# EAGLE design Controller (EAGLE 6.3)
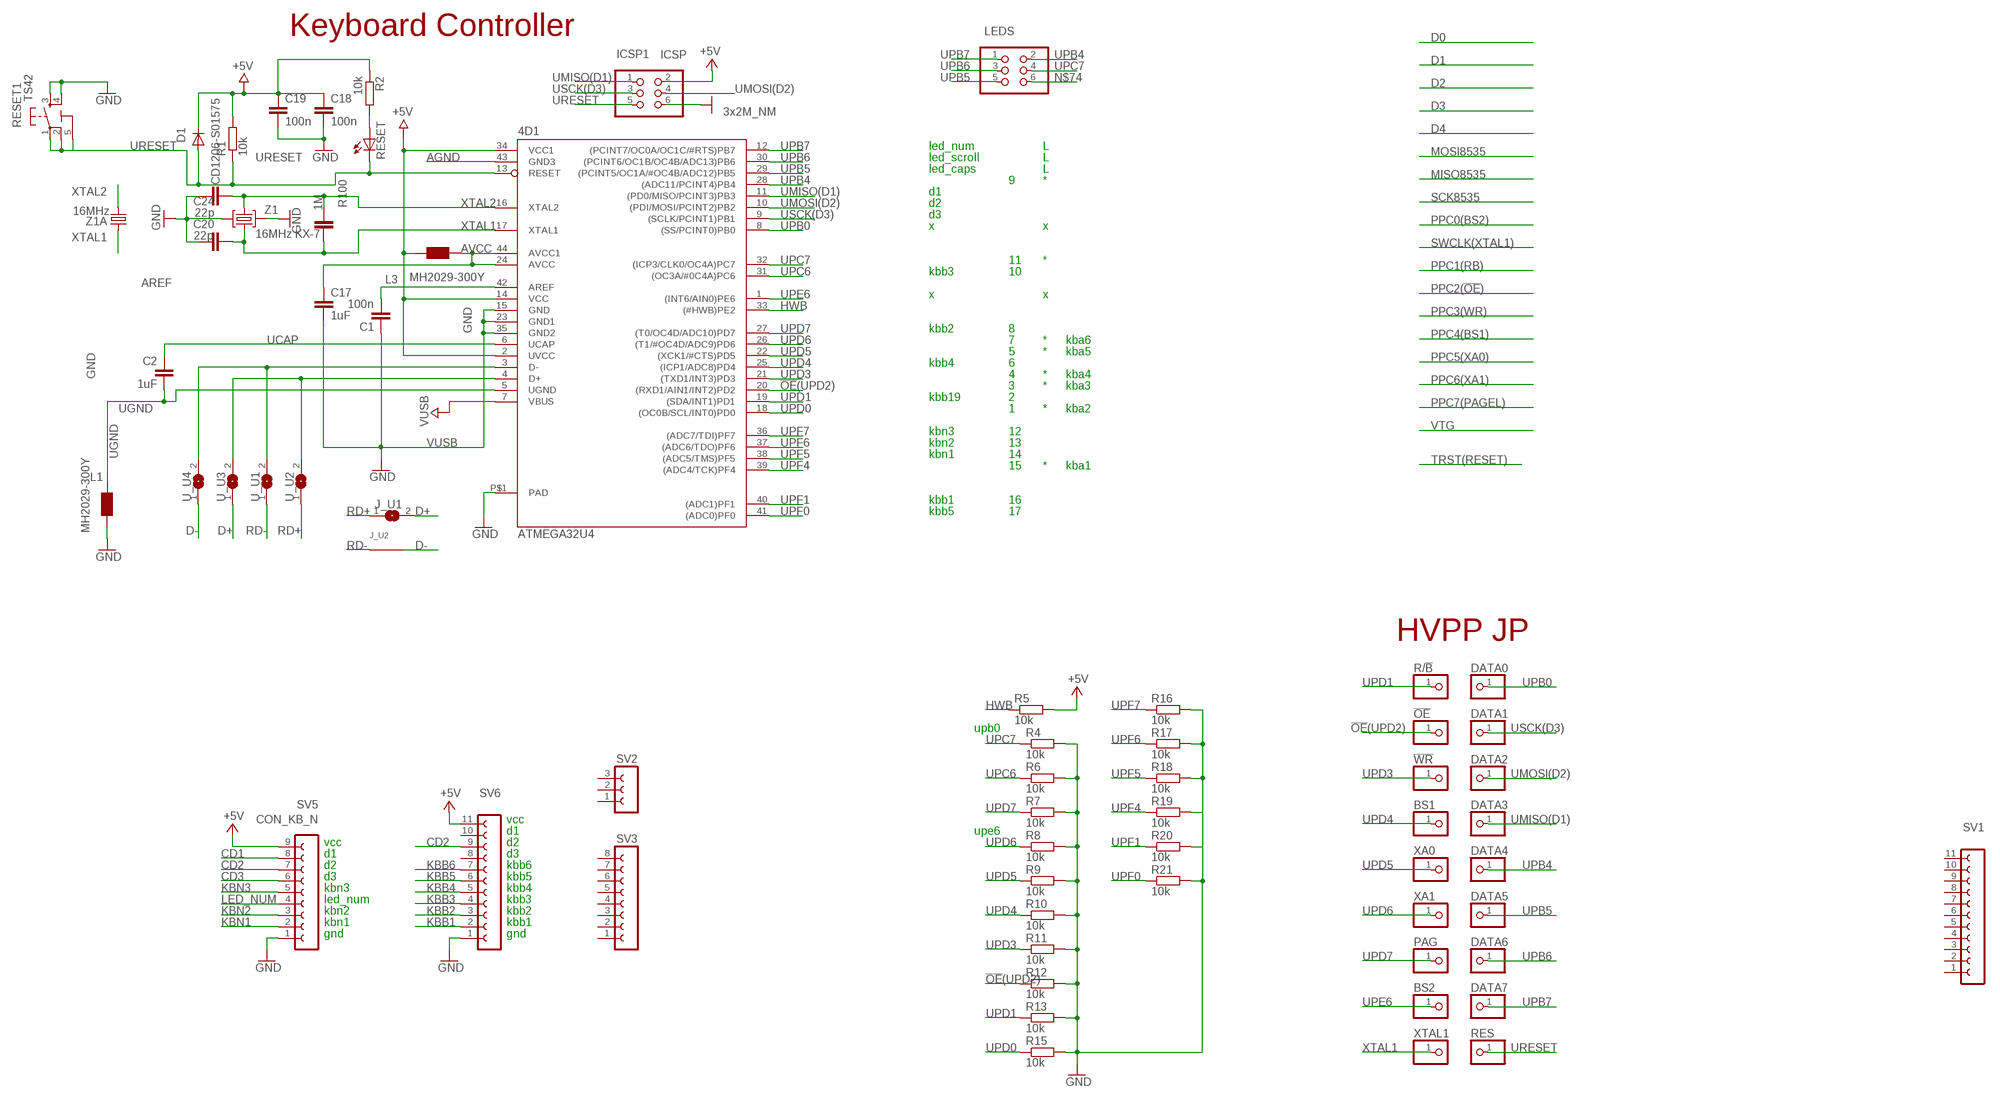
[diagram p0: schematic, sheet 1, part 1 of 2]
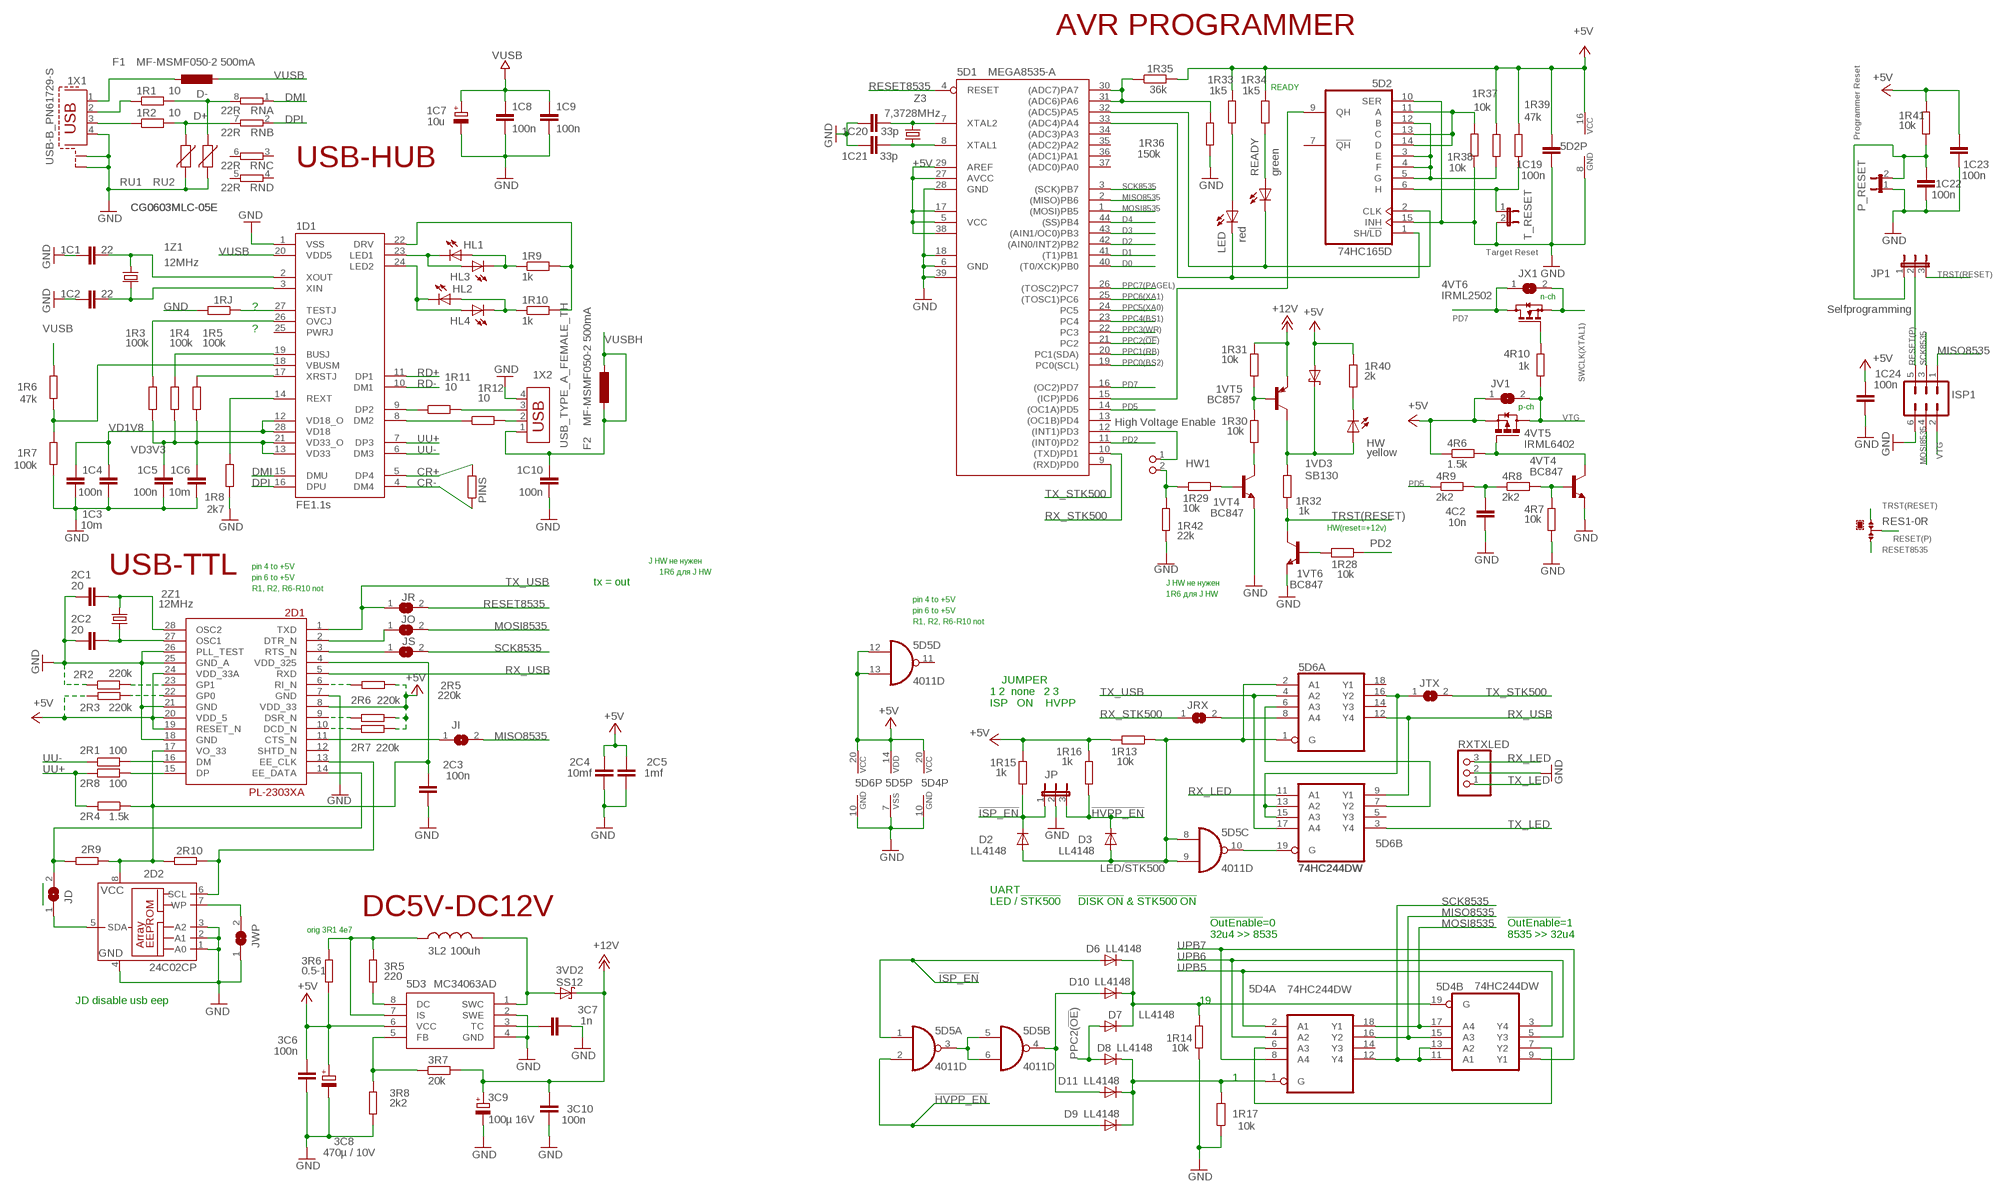
[diagram p1: schematic, sheet 1, part 2 of 2]

## Parts
1C1  22  C-EUC0603  [C0603]
1C2  22  C-EUC0603  [C0603]
1C3  10m  C-EUC1206  [C1206]
1C4  100n  C-EUC0805  [C0805]
1C5  100n  C-EUC0805  [C0805]
1C6  10m  C-EUC1206  [C1206]
1C7  10u  CPOL-EUSMCB  [SMC_B]
1C8  100n  C-EUC0805  [C0805]
1C9  100n  C-EUC0805  [C0805]
1C10  100n  C-EUC0805  [C0805]
1C19  100n  C-EUC0805  [C0805]
1C20  33p  C-EUC0805  [C0805]
1C21  33p  C-EUC0805  [C0805]
1C22  100n  C-EUC0805  [C0805]
1C23  100n  C-EUC0805  [C0805]
1C24  100n  C-EUC0805  [C0805]
1D1  FE1.1S  [FE1.1S_SSOP-28]
1R1  10  R-EU_R0603  [R0603]
1R2  10  R-EU_R0603  [R0603]
1R3  100k  R-EU_R0805  [R0805]
1R4  100k  R-EU_R0805  [R0805]
1R5  100k  R-EU_R1206W  [R1206W]
1R6  47k  R-EU_R1206W  [R1206W]
1R7  100k  R-EU_R0805  [R0805]
1R8  2k7  R-EU_R0805  [R0805]
1R9  1k  R-EU_R0805  [R0805]
1R10  1k  R-EU_R0805  [R0805]
1R11  10  R-EU_R0603  [R0603]
1R12  10  R-EU_R0603  [R0603]
1R13  10k  R-EU_M0805  [M0805]
1R14  10k  R-EU_M0805  [M0805]
1R15  1k  R-EU_M0805  [M0805]
1R16  1k  R-EU_M0805  [M0805]
1R17  10k  R-EU_M0805  [M0805]
1R28  10k  R-EU_R0805  [R0805]
1R29  10k  R-EU_M0805  [M0805]
1R30  10k  R-EU_M0805  [M0805]
1R31  10k  R-EU_M0805  [M0805]
1R32  1k  R-EU_M0805  [M0805]
1R33  1k5  R-EU_M0805  [M0805]
1R34  1k5  R-EU_M0805  [M0805]
1R35  36k  R-EU_M0805  [M0805]
1R36  150k  R-EU_R1206  [R1206]
1R37  10k  R-EU_M0805  [M0805]
1R38  10k  R-EU_M0805  [M0805]
1R39  47k  R-EU_M0805  [M0805]
1R40  2k  R-EU_R1206W  [R1206W]
1R41  10k  R-EU_M0805  [M0805]
1R42  22k  R-EU_M1206  [M1206]
1RJ  R-EU_R0805  [R0805]
1VD3  SB130  SCHOTTKY-DIODESMD  [SMB]
1VT4  BC847  [SOT23]
1VT5  BC857  BC857A-PNP-SOT23-BEC  [SOT23-BEC]
1VT6  BC847  [SOT23]
1X1  USB-B_PN61729-S  [USB-B_PN61729-S]
1X2  USB_TYPE_A_FEMALE_TH  [USB_TYPE_A_FEMALE_TH]
1Z1  12MHz  CRYSTALHC49S  [HC49/S]
2C1  20  C-EUC0805  [C0805]
2C2  20  C-EUC0805  [C0805]
2C3  100n  C-EUC0805  [C0805]
2C4  10mf  C-EUC1210  [C1210]
2C5  1mf  C-EUC0805  [C0805]
2D1  PL-2303XA  [SSOP28DB]
2D2  24C02CP  [DIL8]
2R1  100  R-EU_R0603  [R0603]
2R2  220k  R-EU_R0603  [R0603]
2R3  220k  R-EU_R1206W  [R1206W]
2R4  1.5k  R-EU_R0603  [R0603]
2R5  220k  R-EU_R1206W  [R1206W]
2R6  220k  R-EU_R0603  [R0603]
2R7  220k  R-EU_R0603  [R0603]
2R8  100  R-EU_R0603  [R0603]
2R9  R-EU_R0805  [R0805]
2R10  R-EU_R0805  [R0805]
2Z1  12MHz  CRYSTALHC49S  [HC49/S]
3C6  100n  C-EU025-024X044  [C025-024X044]
3C7  1n  C-EU025-025X050  [C025-025X050]
3C8  470µ / 10V  RCL_CPOL-EUE3.5-8  [RCL_E3,5-8]
3C9  100µ 16V  RCL_CPOL-EUE3.5-8  [RCL_E3,5-8]
3C10  100n  C-EU025-025X050  [C025-025X050]
3L2  100uh  L-US0207/10  [0207/10]
3R5  220  R-EU_R1206  [R1206]
3R6  0.5-1  R-EU_M1206  [M1206]
3R7  20k  R-EU_M0805  [M0805]
3R8  2k2  R-EU_M0805  [M0805]
3VD2  SS12  SCHOTTKY-DIODESMD  [SMB]
4C2  10n  C-EUC1206  [C1206]
4D1  ATMEGA32U4  SMARTPRJ_ATMEGA32U4-XUAU  [SMARTPRJ_TQFP44-PAD]
4R6  1.5k  R-EU_M0805  [M0805]
4R7  10k  R-EU_M0805  [M0805]
4R8  2k2  R-EU_M1206  [M1206]
4R9  2k2  R-EU_M0805  [M0805]
4R10  1k  R-EU_M0805  [M0805]
4VT4  BC847  [SOT23]
4VT5  IRML6402  FDN360P  [SUPER-SOT3]
4VT6  IRML2502  BSS123  [SOT23]
5D1  MEGA8535-A  [TQFP44]
5D2  74HC165D  [SO16]
5D3  MC34063AD  [SOIC8]
5D4  74HC244DW  [SO20W]
5D5  4011D  [SO14]
5D6  74HC244DW  [SO20W]
!OE  PINHD-1X1  [1X01]
!WR  PINHD-1X1  [1X01]
BS1  PINHD-1X1  [1X01]
BS2  PINHD-1X1  [1X01]
C1  100n  C-EUC0603  [C0603-ROUND]
C2  1uF  C-EUC0603  [C0603]
C17  1uF  C-EUC0603  [C0603-ROUND]
C18  100n  C-EUC0603  [C0603]
C19  100n  C-EUC0603  [C0603-ROUND]
C20  22p  C-EUC0603  [C0603]
C24  22p  C-EUC0603  [C0603]
D1  CD1206-S01575  DIODE-MINIMELF  [MINIMELF]
D2  LL4148  [SOD80C]
D3  LL4148  [SOD80C]
D6  LL4148  [SOD80C]
D7  LL4148  [SOD80C]
D8  LL4148  [SOD80C]
D9  LL4148  [SOD80C]
D10  LL4148  [SOD80C]
D11  LL4148  [SOD80C]
DATA0  PINHD-1X1  [1X01]
DATA1  PINHD-1X1  [1X01]
DATA2  PINHD-1X1  [1X01]
DATA3  PINHD-1X1  [1X01]
DATA4  PINHD-1X1  [1X01]
DATA5  PINHD-1X1  [1X01]
DATA6  PINHD-1X1  [1X01]
DATA7  PINHD-1X1  [1X01]
F1  MF-MSMF050-2 500mA  L-EUL1812  [L1812]
F2  MF-MSMF050-2 500mA  L-EUL1812  [L1812]
HL1  LEDSML0603  [SML0603]
HL2  LEDSML0603  [SML0603]
HL3  LEDSML0603  [SML0603]
HL4  LEDSML0603  [SML0603]
HW  yellow  LEDSML0603  [SML0603]
HW1  High Voltage Enable  PINHEAD_PINHD-1X2  [PINHEAD_1X02]
ICSP1  ICSP  PINHD-2X3  [2X03]
ISP1  MA03-2  [MA03-2]
J_U1  SJ  [SJ]
J_U2  J  [R1206W]
JD  SJ  [SJ]
JI  SJ  [SJ]
JO  SJ  [SJ]
JP  JP2E  [JP2]
JP1  Selfprogramming  JUMPER_JP2E  [JUMPER_JP2]
JR  SJ  [SJ]
JRX  SJ  [SJ]
JS  SJ  [SJ]
JTX  SJ  [SJ]
JV1  SJ  [SJ]
JWP  SJ  [SJ]
JX1  SJ  [SJ]
L1  MH2029-300Y  WE-CBF_0805  [0805]
L3  MH2029-300Y  WE-CBF_0805  [0805]
LED  red  LEDSML0603  [SML0603]
LEDS  PINHD-2X3  [2X03]
P_RESET  JP1E  [JP1]
PAG  PINHD-1X1  [1X01]
PINS  R-EU_R0805  [R0805]
R1  10k  R-EU_M0805  [M0805]
R2  10k  R-EU_M0805  [M0805]
R4  10k  R-EU_M0805  [M0805]
R5  10k  R-EU_M1206  [M1206]
R6  10k  R-EU_M0805  [M0805]
R7  10k  R-EU_M0805  [M0805]
R8  10k  R-EU_M0805  [M0805]
R9  10k  R-EU_M0805  [M0805]
R10  10k  R-EU_M0805  [M0805]
R11  10k  R-EU_M0805  [M0805]
R12  10k  R-EU_M0805  [M0805]
R13  10k  R-EU_M0805  [M0805]
R15  10k  R-EU_M0805  [M0805]
R16  10k  R-EU_M0805  [M0805]
R17  10k  R-EU_M0805  [M0805]
R18  10k  R-EU_M0805  [M0805]
R19  10k  R-EU_M0805  [M0805]
R20  10k  R-EU_M0805  [M0805]
R21  10k  R-EU_M0805  [M0805]
R100  1M  C-EUC0805  [C0805]
R/!B  PINHD-1X1  [1X01]
READY  green  LEDSML0603  [SML0603]
RES  PINHD-1X1  [1X01]
RES1  0R-JUMPA  [A0R-JMP]
RESET  LEDSML0805  [SML0805]
RESET1  TS42  [TS42]
RN  22R  4R-NCAY16  [CAY16]
RU1  CG0603MLC-05E  VARISTORCN0603  [CT/CN0603]
RU2  CG0603MLC-05E  VARISTORCN0603  [CT/CN0603]
RXTXLED  PINHD-1X3  [1X03]
SV1  FE12-1  [FE12]
SV2  FE03-1  [FE03-1]
SV3  FE08-1  [FE08]
SV5  CON_KB_N  FE09-1  [FE09]
SV6  FE12-1  [FE12]
T_RESET  JP1E  [JP1]
U_U1  SJ  [SJ]
U_U2  SJ  [SJ]
U_U3  SJ  [SJ]
U_U4  SJ  [SJ]
XA0  PINHD-1X1  [1X01]
XA1  PINHD-1X1  [1X01]
XTAL1  PINHD-1X1  [1X01]
Z1  16MHz KX-7  CRYSTAL-3.2-2.5  [CRYSTAL-3.2-2.5]
Z1A  16MHz  CRYSTALHC49S  [HC49/S]
Z3  7,3728MHz  CRYTALHC49U-V  [HC49U-V]

## Nets
3VUSB2: 2C3.1 2D1.4(VDD_325) 2D1.17(VO_33) 2D2.8(VCC) 2R4.1 2R9.2 2R10.2
!HVPP_EN: 1R16.1 5D5.2(A:I1) D3.C D9.A JP.3
!ISP_EN: 1R15.1 5D5.1(A:I0) D2.C D6.A JP.1
!OE741: 1R17.2 5D4.1(A:G) D8.C D9.C D11.C
!OE!(UPD2): 4D1.20((RXD1/AIN1/INT2)PD2) !OE.1 R12.1
+5V: 1C19.1 1C23.2 1C24.2 1R13.2 1R15.2 1R16.2 1R33.2 1R34.2 1R35.2 1R37.1 1R39.1 1R40.2 1R41.2 1VD3.A 2C4.2 2C5.2 2D1.8(VDD_33) 2D1.19(RESET_N) 2D1.20(VDD_5) 2D1.24(VDD_33A) 2R3.1 2R5.2 2R6.1 2R7.1 3C6.1 3C8.+ 3R6.1 4D1.2(UVCC) 4D1.14(VCC) 4D1.34(VCC1) 4R6.1 4VT5.2(S) 5D1.5(VCC) 5D1.17(VCC1) 5D1.27(AVCC) 5D1.29(AREF) 5D1.38(VCC2) 5D2.16(VCC) 5D3.6(VCC) 5D4.20(P:VCC) 5D5.12(D:I0) 5D5.13(D:I1) 5D5.14(P:VDD) 5D6.20(P:VCC) C18.1 C19.1 D1.C ICSP1.2 JV1.1 L3.1 R1.2 R2.1 R5.2 SV5.9 SV6.11
+12V: 1R31.2 1VT5.E 3C9.+ 3C10.2 3R7.2 3VD2.C
AGND: 4D1.43(GND3)
AREF [aref]: 4D1.42(AREF) C1.2
AVCC: 4D1.24(AVCC) 4D1.44(AVCC1) C17.1 L3.2
CD1: SV5.8
CD2: SV5.7 SV6.9
CD3: SV5.6
CR+: 1D1.5(DP4) PINS.2
CR-: 1D1.4(DM4) PINS.1
D0: 5D1.40((T0/XCK)PB0)
D1: 5D1.41((T1)PB1)
D2: 5D1.42((AIN0/INT2)PB2)
D3: 5D1.43((AIN1/OC0)PB3)
D4: 5D1.44((SS)PB4)
D+: 1R2.2 J_U1.2 RN.7 RU1.1 U_U3.1
D-: 1R1.2 J_U2.1 RN.8 RU2.1 U_U4.1
DMI: 1D1.15(DMU) RN.1
DPI: 1D1.16(DPU) RN.2
GND: 1C1.1 1C2.1 1C3.2 1C4.2 1C5.2 1C6.2 1C7.- 1C8.1 1C9.1 1C10.2 1C19.2 1C20.1 1C21.1 1C22.1 1C23.1 1C24.1 1D1.1(VSS) 1R7.1 1R8.1 1R14.1 1R17.1 1R36.1 1R38.1 1R42.1 1RJ.2 1VT4.2(E) 1VT6.2(E) 1X1.4 1X1.S1 1X1.S2 1X2.4 2C1.1 2C2.1 2C3.2 2C4.1 2C5.1 2D1.7(GND) 2D1.18(GND) 2D1.21(GND) 2D1.25(GND_A) 2D1.26(PLL_TEST) 2D2.1(A0) 2D2.2(A1) 2D2.3(A2) 2D2.4(GND) 2R2.1 3C6.2 3C7.2 3C8.- 3C9.- 3C10.1 3R8.1 4C2.1 4D1.15(GND) 4D1.23(GND1) 4D1.35(GND2) 4D1.P$1(PAD) 4R7.1 4VT4.2(E) 5D1.6(GND) 5D1.18(GND1) 5D1.28(GND) 5D1.39(GND2) 5D2.8(GND) 5D2.10(SER) 5D2.15(INH) 5D3.2(SWE) 5D3.4(GND) 5D4.10(P:GND) 5D5.7(P:VSS) 5D6.10(P:GND) C1.1 C17.2 C18.2 C19.2 C20.1 C24.2 ICSP1.6 ISP1.6 JP.2 JWP.1 L1.2 P_RESET.1 R4.2 R6.2 R7.2 R8.2 R9.2 R10.2 R11.2 R12.2 R13.2 R15.2 R16.2 R17.2 R18.2 R19.2 R20.2 R21.2 RESET1.3 RESET1.4 RU1.2 RU2.2 RXTXLED.2 SV5.1 SV6.1 T_RESET.2 Z1.2(GND) Z1.4(GND) ; supply symbol labelled 3x2M_NM
HWB: 4D1.33((#HWB)PE2) R5.1
ID+: 1R2.1 1X1.3
ID-: 1R1.1 1X1.2
KBB1: SV6.2
KBB2: SV6.3
KBB3: SV6.4
KBB4: SV6.5
KBB5: SV6.6
KBB6: SV6.7
KBN1: SV5.2
KBN2: SV5.3
KBN3: SV5.5
LED/!STK500: 1R13.1 5D5.8(C:I0) 5D5.9(C:I1) 5D6.1(A:G) 5D6.2(A:A1) D2.A D3.A
LED_NUM: SV5.4
MISO8535: 5D1.2((MISO)PB6) 5D4.15(B:A3) 5D4.16(A:Y2) ISP1.1 JI.2
MOSI8535: 5D1.1((MOSI)PB5) 5D4.17(B:A4) 5D4.18(A:Y1) ISP1.4 JO.2
N1: 5D1.33((ADC4)PA4) 5D2.1(SH/!LD) LED.C
N$2: 5D5.10(C:O) 5D6.19(B:G)
N$3: R2.2 RESET.A
N$4: 5D4.6(A:A3) 5D4.7(B:Y2)
N$5: 1D1.9(DP2) 1R11.1
N$6: 1D1.8(DM2) 1R12.1
N$7: 1X1.1 F1.2
N$8: 1C1.2 1D1.2(XOUT) 1Z1.1
N$9: 1C2.2 1D1.3(XIN) 1Z1.2
N$10: 1D1.17(XRSTJ) 1R5.2
N$11: 1D1.22(DRV) 1R9.2 1R10.2
N$12: 1R11.2 1X2.3
N$13: 1R12.2 1X2.2
N$14: 1D1.23(LED1) HL1.C HL3.A
N$15: 1D1.19(BUSJ) 1R4.2
N$16: 1D1.18(VBUSM) 1R6.1 1R7.2
N$17: 1D1.24(LED2) HL2.C HL4.A
N$18: 1R10.1 HL2.A HL4.C
N$19: 1D1.26(OVCJ) 1R3.2
N$20: 4D1.4(D+) U_U2.2 U_U3.2
N$21: 1D1.14(REXT) 1R8.2
N$22: 5D6.13(B:A2) 5D6.15(B:A3) 5D6.16(A:Y2) JTX.1
N$23: 1D1.27(TESTJ) 1RJ.1
N$24: 5D6.8(A:A4) JRX.2
N$25: 4D1.3(D-) U_U1.2 U_U4.2
N$26: 5D6.6(A:A3) 5D6.7(B:Y2)
N$27: 2D2.5(SDA) JD.1
N$28: 1R34.1 READY.A
N$29: 5D5.3(A:O) 5D5.5(B:I0) 5D5.6(B:I1)
N$31: 1R9.1 HL1.A HL3.C
N$32: 1R35.1 1R36.2 5D1.30((ADC7)PA7) 5D1.31((ADC6)PA6)
N$33: 5D1.32((ADC5)PA5) 5D2.2(CLK) READY.C
N$34: 1R39.2 5D2.6(H) T_RESET.1
N$35: 5D1.12((INT1)PD3) HW1.1
N$36: 1R29.2 1R42.2 HW1.2
N$37: 2D2.7(WP) JWP.2
N$39: 1R32.2 1VD3.C 1VT5.C HW.A
N$40: 1R29.1 1VT4.1(B)
N$43: 1R14.2 5D4.19(B:G) D6.C D7.C D10.C
N$45: 1R30.1 1VT4.3(C)
N$46: 1R30.2 1R31.1 1VT5.B
N$47: 5D1.15((ICP)PD6) 5D2.9(QH)
N$48: 1R33.1 LED.A
N$49: 1R38.2 5D2.11(A) 5D2.13(C) 5D2.14(D)
N$52: 2D1.15(DP) 2R8.2
N$53: 2D1.16(DM) 2R1.2
N$54: 2D1.23(GP1) 2R2.2
N$55: 2D1.22(GP0) 2R3.2
N$56: 2C1.2 2D1.28(OSC2) 2Z1.2
N$57: 2C2.2 2D1.27(OSC1) 2Z1.1
N$58: 2D1.6(RI_N) 2R5.1
N$59: 2D1.9(DSR_N) 2R6.2
N$60: 2D1.10(DCD_N) 2R7.2
N$61: 2D1.11(CTS_N) JI.1
N$62: 2D1.3(RTS_N) JS.1
N$63: 2D1.2(DTR_N) JO.1
N$65: 1R37.2 5D2.3(E) 5D2.4(F) 5D2.5(G) 5D2.12(B)
N$66: 2D1.14(EE_DATA) 2R9.1 JD.2
N$68: 2D1.13(EE_CLK) 2D2.6(SCL) 2R10.1
N$69: 1R28.2 1VT6.1(B)
N$70: 3R5.1 5D3.8(DC)
N$74: LEDS.6
N$75: 3L2.1 3R5.2 3R6.2 5D3.7(IS)
N$76: 5D5.4(B:O) D10.A D11.A
N$79: 3R7.1 3R8.2 5D3.5(FB)
N$80: 3L2.2 3VD2.A 5D3.1(SWC)
N$81: 3C7.1 5D3.3(TC)
N$82: 1C20.2 5D1.7(XTAL2) Z3.2
N$83: 1C21.2 5D1.8(XTAL1) Z3.1
N$84: 4R6.2 4VT4.3(C) 4VT5.1(G)
N$85: 4R7.2 4R8.2 4VT4.1(B)
N$86: 4C2.2 4R8.1 4R9.2
N$95: 1R40.1 HW.C
N$96: 4R10.2 4VT6.1(G)
PD2: 1R28.1 5D1.11((INT0)PD2)
PD5: 4R9.1 5D1.14((OC1A)PD5)
PD7: 4VT6.3(D) 5D1.16((OC2)PD7) JX1.1
PPC0(BS2): 5D1.19(PC0(SCL))
PPC1(RB): 5D1.20(PC1(SDA))
PPC2(!OE!): 5D1.21(PC2) D7.A D8.A
PPC3(WR): 5D1.22(PC3)
PPC4(BS1): 5D1.23(PC4)
PPC5(XA0): 5D1.24(PC5)
PPC6(XA1): 5D1.25((TOSC1)PC6)
PPC7(PAGEL): 5D1.26((TOSC2)PC7)
RD+: 1D1.11(DP1) J_U1.1 U_U2.1
RD-: 1D1.10(DM1) J_U2.2 U_U1.1
RESET8535: 1C22.2 1R41.1 5D1.4(RESET) JP1.1 JR.2 P_RESET.2 RES1.3
RESET(P): ISP1.5 JP1.2 RES1.2
RX_LED: 5D6.11(B:A1) RXTXLED.3
RX_STK500: 5D1.10((TXD)PD1) JRX.1
RX_USB: 2D1.5(RXD) 5D6.9(B:Y1) 5D6.12(A:Y4)
SCK8535: 5D1.3((SCK)PB7) 5D4.11(B:A1) 5D4.12(A:Y4) 5D4.13(B:A2) ISP1.3 JS.2
SWCLK(XTAL1): 4VT6.2(S) JX1.2
TRST(RESET): 1R32.1 1VT6.3(C) JP1.3 RES1.1
TX_LED: 5D6.3(B:Y4) RXTXLED.1
TX_STK500: 5D1.9((RXD)PD0) JTX.2
TX_USB: 2D1.1(TXD) 5D6.4(A:A2) 5D6.17(B:A4) JR.1
UCAP: 4D1.6(UCAP) C2.1
UGND [gnd]: 4D1.5(UGND) C2.2 L1.1
UMISO(D1): 4D1.11((PD0/MISO/PCINT3)PB3) DATA3.1 ICSP1.1
UMOSI(D2): 4D1.10((PDI/MOSI/PCINT2)PB2) DATA2.1 ICSP1.4
UPB0: 4D1.8((SS/PCINT0)PB0) DATA0.1
UPB4: 4D1.28((ADC11/PCINT4)PB4) DATA4.1 LEDS.2
UPB5: 4D1.29((PCINT5/OC1A/#OC4B/ADC12)PB5) 5D4.2(A:A1) 5D4.3(B:Y4) DATA5.1 LEDS.5
UPB6: 4D1.30((PCINT6/OC1B/OC4B/ADC13)PB6) 5D4.4(A:A2) 5D4.5(B:Y3) DATA6.1 LEDS.3
UPB7: 4D1.12((PCINT7/OC0A/OC1C/#RTS)PB7) 5D4.8(A:A4) 5D4.9(B:Y1) DATA7.1 LEDS.1
UPC6: 4D1.31((OC3A/#0C4A)PC6) R6.1
UPC7: 4D1.32((ICP3/CLK0/OC4A)PC7) LEDS.4 R4.1
UPD0: 4D1.18((OC0B/SCL/INT0)PD0) R15.1
UPD1: 4D1.19((SDA/INT1)PD1) R13.1 R/!B.1
UPD3: 4D1.21((TXD1/INT3)PD3) !WR.1 R11.1
UPD4: 4D1.25((ICP1/ADC8)PD4) BS1.1 R10.1
UPD5: 4D1.22((XCK1/#CTS)PD5) R9.1 XA0.1
UPD6: 4D1.26((T1/#OC4D/ADC9)PD6) R8.1 XA1.1
UPD7: 4D1.27((T0/OC4D/ADC10)PD7) PAG.1 R7.1
UPE6: 4D1.1((INT6/AIN0)PE6) BS2.1
UPF0: 4D1.41((ADC0)PF0) R21.1
UPF1: 4D1.40((ADC1)PF1) R20.1
UPF4: 4D1.39((ADC4/TCK)PF4) R19.1
UPF5: 4D1.38((ADC5/TMS)PF5) R18.1
UPF6: 4D1.37((ADC6/TDO)PF6) R17.1
UPF7: 4D1.36((ADC7/TDI)PF7) R16.1
URESET: 4D1.13(RESET) D1.A ICSP1.5 R1.1 RES.1 RESET1.1 RESET1.2 RESET1.5(5-GND) RESET.C
USCK(D3): 4D1.9((SCLK/PCINT1)PB1) DATA1.1 ICSP1.3
UU+: 1D1.7(DP3) 2R4.2 2R8.1
UU-: 1D1.6(DM3) 2R1.1
VD1V8: 1C3.1 1C4.1 1D1.12(VD18_O) 1D1.28(VD18)
VD3V3: 1C5.1 1C6.1 1D1.13(VD33) 1D1.21(VD33_O) 1R3.1 1R4.1 1R5.1
VTG: 4R10.1 4VT5.3(D) ISP1.2 JV1.2
VUSB: 1C7.+ 1C8.2 1C9.2 1D1.20(VDD5) 1R6.2 4D1.7(VBUS) F1.1
VUSBH: 1C10.1 1X2.1 F2.1 F2.2
XTAL1: 4D1.17(XTAL1) C20.2 R100.2 XTAL1.1 Z1.3(C2) Z1A.2
XTAL2: 4D1.16(XTAL2) C24.1 R100.1 Z1.1(C1) Z1A.1
Unconnected: 1D1.25(PWRJ) 2D1.12(SHTD_N) 5D1.13((OC1B)PD4) 5D1.34((ADC3)PA3) 5D1.35((ADC2)PA2) 5D1.36((ADC1)PA1) 5D1.37((ADC0)PA0) 5D2.7(!QH) 5D4.14(A:Y3) 5D5.11(D:O) 5D6.5(B:Y3) 5D6.14(A:Y3) 5D6.18(A:Y1) RN.3 RN.4 RN.5 RN.6 SV1.1 SV1.2 SV1.3 SV1.4 SV1.5 SV1.6 SV1.7 SV1.8 SV1.9 SV1.10 SV1.11 SV2.1 SV2.2 SV2.3 SV3.1 SV3.2 SV3.3 SV3.4 SV3.5 SV3.6 SV3.7 SV3.8 SV6.8 SV6.10

## Notes on the sheet
- Keyboard Controller
- led_num | L
- led_scroll | L
- led_caps | L
- 9 | *
- d1
- d2
- d3
- x | x
- 11 | *
- kbb3 | 10
- x | x
- kbb2 | 8
- 7 | * | kba6
- 5 | * | kba5
- kbb4 | 6
- 4 | * | kba4
- 3 | * | kba3
- kbb19 | 2
- 1 | * | kba2
- kbn3 | 12
- kbn2 | 13
- kbn1 | 14
- 15 | * | kba1
- kbb1 | 16
- kbb5 | 17
- HVPP JP
- upb0
- vcc
- d1 | upe6
- vcc | d2
- d1 | d3
- d2 | kbb6
- d3 | kbb5
- kbn3 | kbb4
- led_num | kbb3
- kbn2 | kbb2
- kbn1 | kbb1
- gnd | gnd
- AVR PROGRAMMER
- READY
- Programmer Reset
- USB-HUB
- Target Reset
- n-ch
- ?
- ?
- p-ch
- HW(reset=+12v)
- J HW не нужен
- pin 4 to +5V
- USB-TTL | 1R6 для J HW
- pin 6 to +5V
- tx = out | J HW не нужен
- R1, R2, R6-R10 not
- 1R6 для J HW
- pin 4 to +5V
- pin 6 to +5V
- R1, R2, R6-R10 not
- JUMPER
  1 2  none   2 3
  ISP   ON    HVPP
- UART
  LED / !STK500
- !DISK ON! & !STK500 ON
- DC5V-DC12V
- orig 3R1 4e7
- !OutEnable!=0
  32u4 >> 8535
- !OutEnable!=1
  8535 >> 32u4
- JD disable usb eep | 19
- 1

## Library data of the parts
1C1-1C6 1C8-1C10 1C19-1C24 2C4 2C5 3C7 3C10 4C2 C2 C18 C20 C24 R100 = rcl:C-EU: CAPACITOR, European symbol
1C7 = rcl:CPOL-EU: POLARIZED CAPACITOR, European symbol
1D1 = imcom:FE1.1S: A USB 2.0 hub IC. http://www.jfd-ic.com/Documents/FE1.1s%20Data%20Sheet%20%28Rev.%201.0%29.pdf
1R1-1R17 1R28-1R42 1RJ 3R5-3R8 4R6-4R10 PINS R1 R2 R4-R13 R15-R21 = rcl:R-EU_: RESISTOR, European symbol
1VD3 3VD2 = diode:SCHOTTKY-DIODE: Schottky Diode
1VT4 1VT6 = transistor:BC847: NPN TRANSISTOR
1VT5 = transistor:*-PNP-: PNP Transistror
1X1 = detali_controller:USB-B_PN61729-S: BERG USB connector
1X2 = imcom:USB_TYPE_A_FEMALE_TH: USB Type A Female Through Hole. http://datasheet.octopart.com/787616-1-Tyco-Electronics-datasheet-61477.pdf
1Z1 2Z1 Z1A = crystal:CRYSTAL: CRYSTAL; OC_FARNELL: 1667008; OC_NEWARK: unknown
2C1-2C3 = resistor:C-EU: CAPACITOR, European symbol
2D1 = SparkFun-DigitalIC:PL-2303XA: Prolific USB chip, requires 12MHz xtal
2D2 = microchip:24C*: Serial EEPROM 1 K/2 K/4 K; MF: MICROCHIP; MPN: 24C02C/P; OC_FARNELL: 1296567; OC_NEWARK: 96K4064
2R1-2R8 = resistor:R-EU_: RESISTOR, European symbol
2R9 2R10 = keycopy:R-EU_: RESISTOR, European symbol
3C6 = rc-elektronik:C-EU: CAPACITOR, European symbol
3C8 3C9 = HWProgUSB:RCL_CPOL-EU: POLARIZED CAPACITOR, European symbol
3L2 = rcl:L-US: INDUCTOR, American symbol
4D1 = detali_main:SMARTPRJ_ATMEGA32U4-XU
4VT4 = transistor-neu-to92:BC847: NPN TRANSISTOR
4VT5 = transistor-power:FDN360P: Single P-Channel, PowerTrench (R) MOSFET Source: http://www.fairchildsemi.com/ds/FD/FDN360P.pdf
4VT6 = transistor-small-signal:BSS123: N-CHANNEL MOS FET
5D1 = atmel:MEGA8535: MICROCONTROLLER 8 Kbytes FLASH 512 bytes SRAM 512 bytes EEPROM USART 8-channel 10 bit ADC Source: avr.lbr; MPN: ATMEGA8535-16AU; OC_FARNELL: 1528437; OC_NEWARK: 01M6908
5D2 = 74xx-eu:74*165: 8-bit parallel load SHIFT REGISTER
5D3 = mc34063:MC34063
5D4 5D6 = 74xx-eu:74*244: Octal BUFFER and LINE DRIVER, 3-state
5D5 = 40xx:4011: Quad 2-input NAND
!OE !WR BS1 BS2 DATA0 DATA1-DATA7 PAG R/!B RES XA0 XA1 XTAL1 = pinhead:PINHD-1X1: PIN HEADER
C1 C17 C19 = SmartPrj:C-EU: CAPACITOR, European symbol
D1 = diode:DIODE-: DIODE
D2 D3 D6-D11 = detali_controller:LL4148: DIODE high speed
F1 F2 = rcl:L-EU: INDUCTOR, European symbol
HL1-HL4 HW LED READY RESET = led:LED: LED OSRAM: - CHIPLED LG R971, LG N971, LY N971, LG Q971, LY Q971, LO R971, LY R971 LH N974, LH R974 LS Q976, LO Q976, LY Q976 LO Q996 - Hyper CHIPLED LW Q18S LB Q993, LB Q99A, LB R99A - SideLED LS A670, LO A670, LY A670, LG A670, LP A670 LB A673, LV A673, LT A673, LW A673 LH A674 LY A675 LS A676, LA A676, LO A676, LY A676, LW A676 LS A679, LY A679, LG A679 - Hyper Micro SIDELED® LS Y876, LA Y876, LO Y876, LY Y876 LT Y87S - SmartLED LW L88C, LW L88S LB L89C, LB L89S, LG L890 LS L89K, LO L89K, LY L89K LS L896, LA L896, LO L896, LY L896 - TOPLED LS T670, LO T670, LY T670, LG T670, LP T670 LSG T670, LSP T670, LSY T670, LOP T670, LYG T670 LG T671, LOG T671, LSG T671 LB T673, LV T673, LT T673, LW T673 LH T674 LS T676, LA T676, LO T676, LY T676, LB T676, LH T676, LSB T676, LW T676 LB T67C, LV T67C, LT T67C, LS T67K, LO T67K, LY T67K, LW E67C LS E67B, LA E67B, LO E67B, LY E67B, LB E67C, LV E67C, LT E67C LW T67C LS T679, LY T679, LG T679 LS T770, LO T770, LY T770, LG T770, LP T770 LB T773, LV T773, LT T773, LW T773 LH T774 LS E675, LA E675, LY E675, LS T675 LS T776, LA T776, LO T776, LY T776, LB T776 LHGB T686 LT T68C, LB T68C - Hyper Mini TOPLED® LB M676 - Mini TOPLED Santana® LG M470 LS M47K, LO M47K, LY M47K Source: http://www.osram.convergy.de LUXEON: - LUMILED® LXK2-PW12-R00, LXK2-PW12-S00, LXK2-PW14-U00, LXK2-PW14-V00 LXK2-PM12-R00, LXK2-PM12-S00, LXK2-PM14-U00 LXK2-PE12-Q00, LXK2-PE12-R00, LXK2-PE12-S00, LXK2-PE14-T00, LXK2-PE14-U00 LXK2-PB12-K00, LXK2-PB12-L00, LXK2-PB12-M00, LXK2-PB14-N00, LXK2-PB14-P00, LXK2-PB14-Q00 LXK2-PR12-L00, LXK2-PR12-M00, LXK2-PR14-Q00, LXK2-PR14-R00 LXK2-PD12-Q00, LXK2-PD12-R00, LXK2-PD12-S00 LXK2-PH12-R00, LXK2-PH12-S00 LXK2-PL12-P00, LXK2-PL12-Q00, LXK2-PL12-R00 Source: www.luxeon.com KINGBRIGHT: KA-3528ASYC Source: www.kingbright.com
HW1 = HWProgUSB:PINHEAD_PINHD-1X2: PIN HEADER
ICSP1 LEDS = SmartPrj:PINHD-2X3: PIN HEADER
ISP1 = con-lstb:MA03-2: PIN HEADER
J_U1 JD JI JO JR JRX JS JTX JV1 JWP JX1 U_U1-U_U4 = jumper:SJ: SMD solder JUMPER
J_U2 = detali_controller:J
JP = jumper:JP2E: JUMPER
JP1 = HWProgUSB:JUMPER_JP2E: JUMPER
L1 L3 = wuerth-elektronik:WE-CBF: SMD EMI Suppression Ferrite Beads - excellent anti-EMI properties - low DCR - impedances till 3000 ohms - rated current up to 6 A
P_RESET T_RESET = jumper:JP1E: JUMPER
RES1 = jump-0r-smd:0R-JUMP: SMD 0R 0805 Jumper
RESET1 = SmartPrj:TS42: TS42 Dongnan Electronics Tact switch VDC 12V - 50mA
RN = resistor-dil:4R-N: Array Chip Resistor Source: RS Component / Phycomp
RU1 RU2 = varistor:VARISTOR: VARISTOR
RXTXLED = pinhead:PINHD-1X3: PIN HEADER
SV1 SV6 = detali_main:FE12-1: FEMALE HEADER; OC_FARNELL: unknown; OC_NEWARK: unknown
SV2 = detali_main:FE03-1: FEMALE HEADER; OC_FARNELL: unknown; OC_NEWARK: unknown
SV3 = detali_main:FE08-1: FEMALE HEADER; OC_FARNELL: unknown; OC_NEWARK: unknown
SV5 = detali_main:FE09-1: FEMALE HEADER; OC_FARNELL: unknown; OC_NEWARK: unknown
Z1 = SmartPrj:CRYSTAL-3.2-2.5
Z3 = crystal:CRYTAL: CRYSTAL

## Net classes
1 power: width 0.254 mm, drill 0.61 mm, clearance 0.254 mm
2 gnd: width 0.305 mm, drill 0.559 mm, clearance 0.254 mm
3 usbvcc: width 0.508 mm, drill 0.61 mm, clearance 0.254 mm
4 aref: width 0.254 mm, drill 0.61 mm, clearance 0.254 mm

## Board
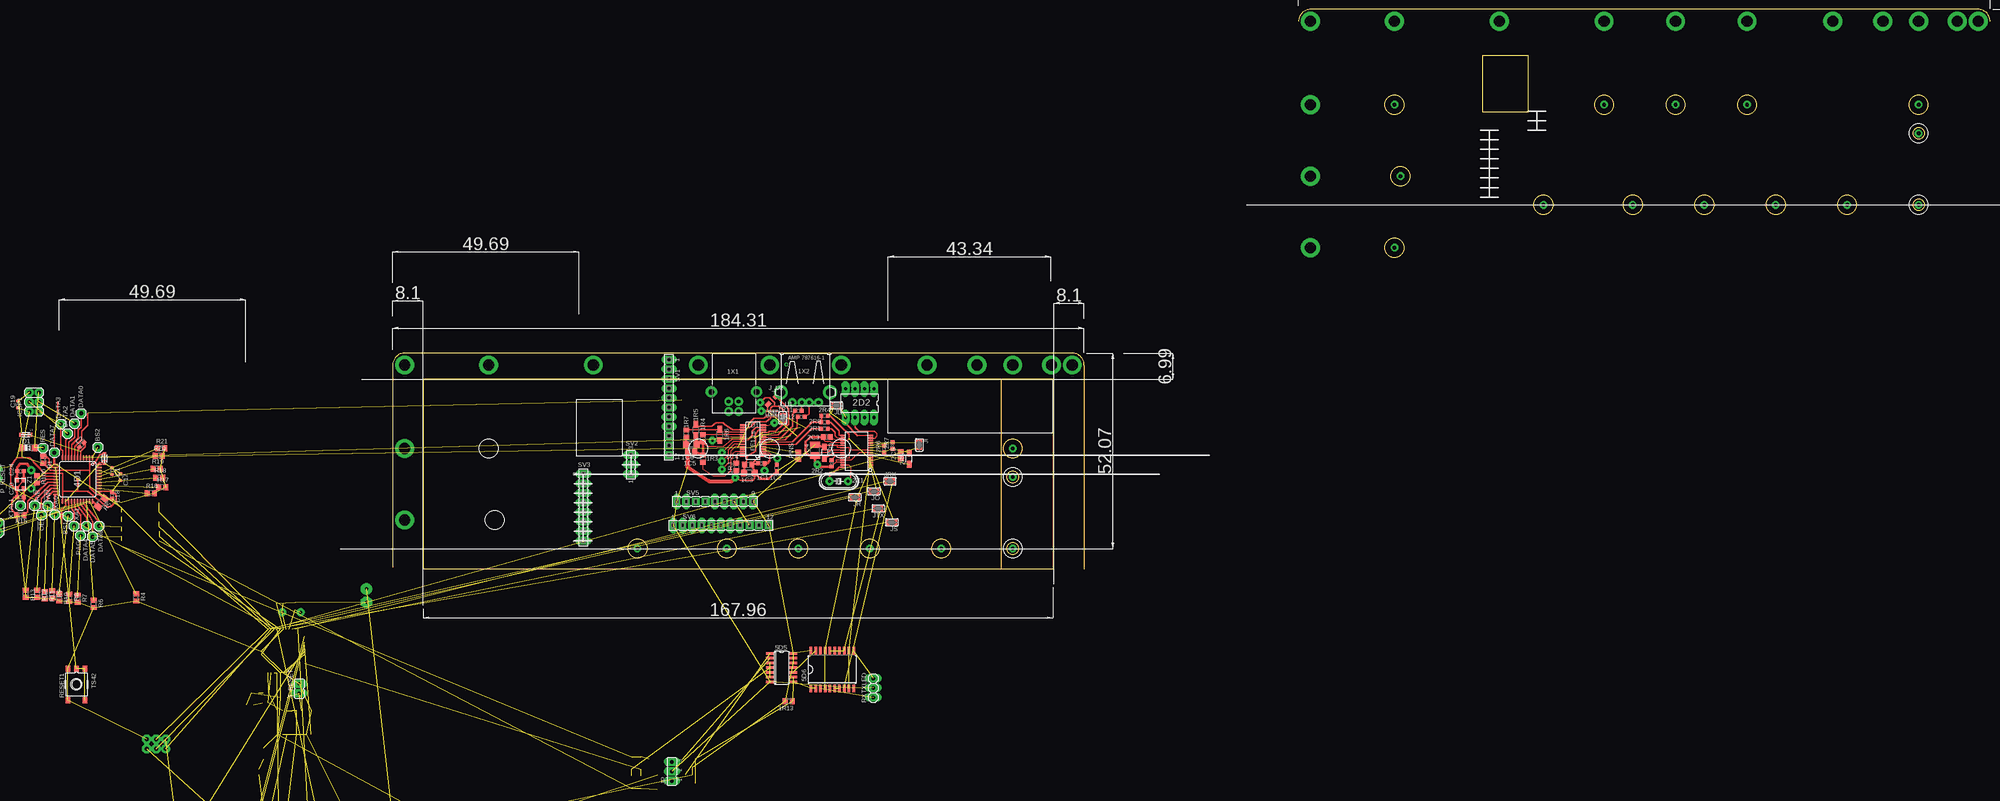
[diagram p2: board, top side]
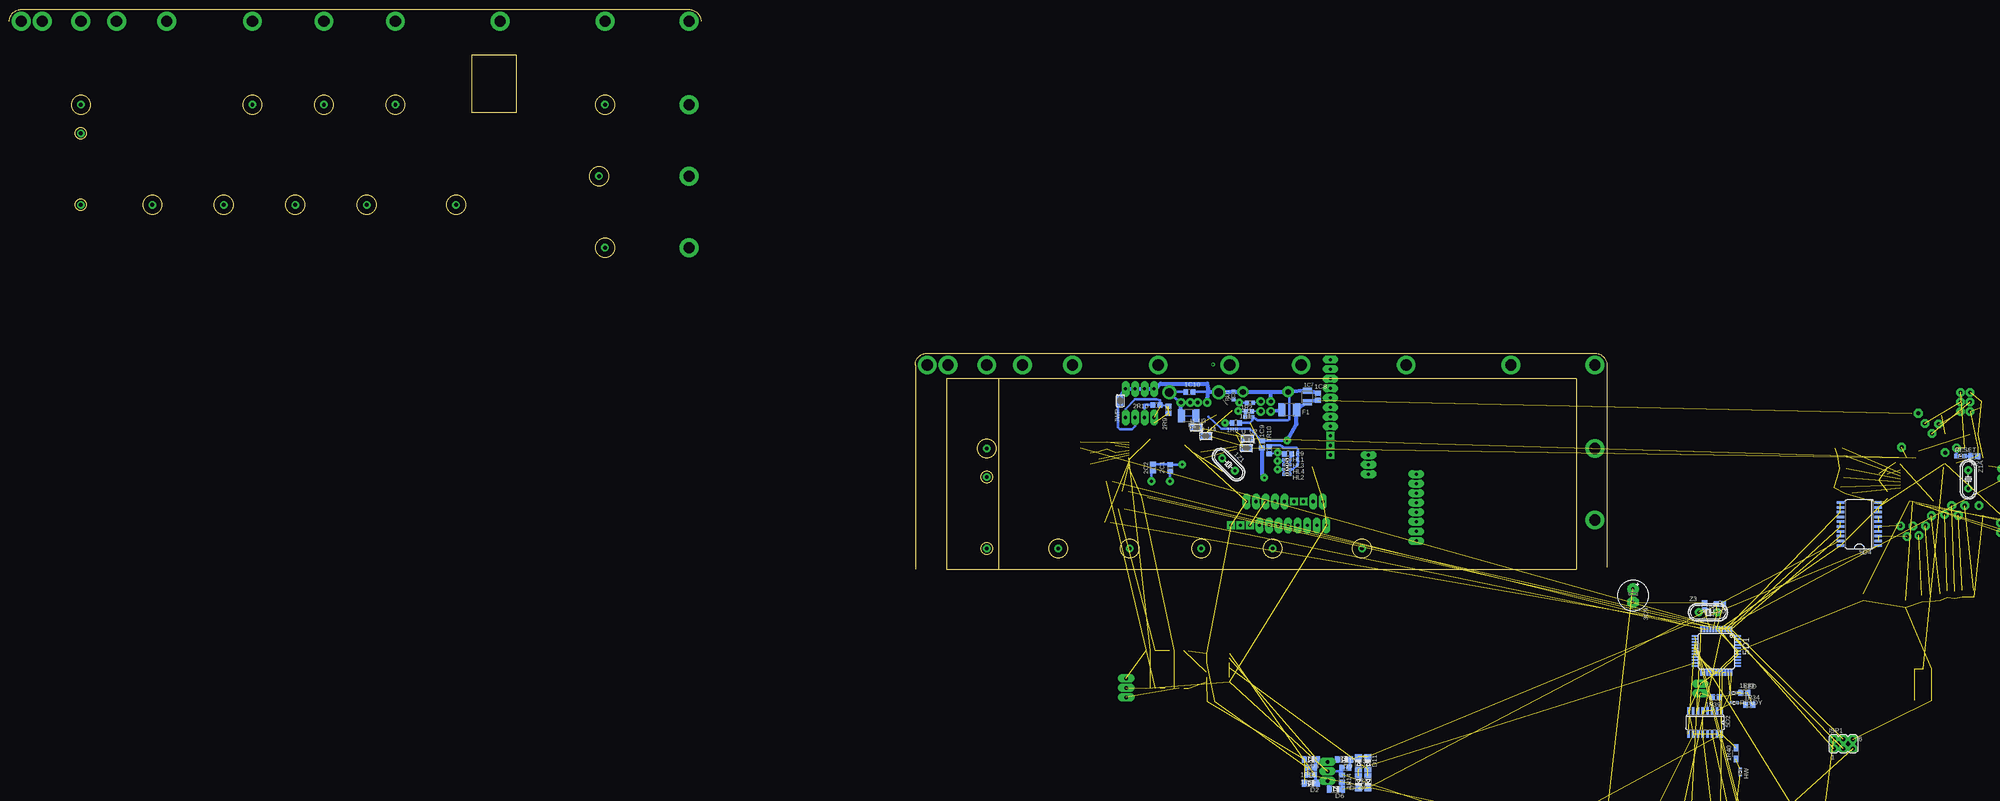
[diagram p3: board, bottom side, seen from below]

Size 425.77 x 149.22 mm. Coordinates in mm from the lower left corner, seen from the top.
Outline: 162.08,50.8 8.1,50.8 8.1,0 162.08,0
Outline: 162.08,50.8 176.05,50.8 176.05,0 162.08,0
Outline: 425.77,146.05 arc90 422.59,149.23 244.63,149.23 arc90 241.46,146.05
Outline: 0,0.64 0,54.45 arc-90 3.17,57.63 181.13,57.63 arc-90 184.31,54.45 184.31,0
Outline: 162.08,50.8 162.08,0
Outline: 290.51,137 302.58,137 302.58,121.76 290.51,121.76 290.51,137
Outline: circle at 165.26,5.56 radius 1.5
Outline: circle at 146.21,5.56 radius 2.5
Outline: circle at 127.16,5.56 radius 2.5
Outline: circle at 108.11,5.56 radius 2.5
Outline: circle at 89.06,5.56 radius 2.5
Outline: circle at 165.26,24.61 radius 1.5
Outline: circle at 165.26,32.23 radius 2.5
Outline: circle at 65.25,5.56 radius 2.5
Outline: circle at 406.72,97.16 radius 1.5
Outline: circle at 387.67,97.16 radius 2.5
Outline: circle at 368.62,97.16 radius 2.5
Outline: circle at 349.57,97.16 radius 2.5
Outline: circle at 330.52,97.16 radius 2.5
Outline: circle at 267.02,85.72 radius 2.5
Outline: circle at 268.6,104.78 radius 2.5
Outline: circle at 267.02,123.83 radius 2.5
Outline: circle at 406.72,116.21 radius 1.5
Outline: circle at 361,123.83 radius 2.5
Outline: circle at 341.95,123.83 radius 2.5
Outline: circle at 322.9,123.83 radius 2.5
Copper layers (1*16): Top 0.035mm / dielectric 1.5mm / Bottom 0.035mm
Design rules "DesignRules": minimum track width 8mil, minimum drill 24mil, track to track 0.2mm, track to pad 0.2mm, pad to pad 8mil, via to via 8mil, smd to smd 8mil, copper to edge 10mil, drill to drill 8mil, minimum pad ring 0.65mm, minimum via ring 8mil, stop-mask expansion 4mil, vias tented up to drill 0mil, thermal gap 10mil

### Footprints (pad centres in the part's own frame; a part is rotated, then mirrored left to right if it is on the bottom)
C0603 = smd 1.1 x 1: 1 -0.85,0; 2 0.85,0
C1206 = smd 1.6 x 1.8: 1 -1.4,0; 2 1.4,0
C0805 = smd 1.3 x 1.5: 1 -0.95,0; 2 0.95,0
SMC_B = smd 1.6 x 2.4: + -1.5,0; - 1.5,0
FE1.1S_SSOP-28 = smd 0.35 x 1.5: 1 -4.16,-2.7; 2 -3.52,-2.7; 3 -2.88,-2.7; 4 -2.24,-2.7; 5 -1.6,-2.7; 6 -0.96,-2.7; 7 -0.32,-2.7; 8 0.32,-2.7; 9 0.96,-2.7; 10 1.6,-2.7; 11 2.24,-2.7; 12 2.88,-2.7; 13 3.52,-2.7; 14 4.16,-2.7; 15 4.16,2.7; 16 3.52,2.7; 17 2.88,2.7; 18 2.24,2.7; 19 1.6,2.7; 20 0.96,2.7; 21 0.32,2.7; 22 -0.3,2.7; 23 -0.96,2.7; 24 -1.6,2.7; 25 -2.24,2.7; 26 -2.88,2.7; 27 -3.52,2.7; 28 -4.16,2.7
R0603 = smd 1 x 1.1: 1 -0.85,0; 2 0.85,0
R0805 = smd 1.3 x 1.5: 1 -0.95,0; 2 0.95,0
R1206W = smd 1.8 x 1.2: 1 -1.499,0; 2 1.499,0
M0805 = smd 1.3 x 1.6: 1 -0.95,0; 2 0.95,0
R1206 = smd 1.6 x 1.803: 1 -1.422,0; 2 1.422,0
M1206 = smd 1.6 x 2: 1 -1.4,0; 2 1.4,0
SMB = smd 2.4 x 2.4: A 2.2,0; C -2.2,0
SOT23 = smd 1 x 1.4: 1 -0.95,-1.1; 2 0.95,-1.1; 3 0,1.1
SOT23-BEC = smd 1 x 1.4: B -0.95,-1.1; C 0,1.1; E 0.95,-1.1
USB-B_PN61729-S = drill 1 pad 2: 1 1.409,5.186; 2 -1.25,5.186; 3 -1.25,2.551; 4 1.409,2.551 | drill 1.5 pad 3: S1 -6.02,0; S2 6.02,0
USB_TYPE_A_FEMALE_TH = drill 1: 1 -3.5,5.37; 2 -1,5.37; 3 1,5.37; 4 3.5,5.37 | drill 2.286: P$1 -6.57,2.66; P$2 6.57,2.66
HC49/S = drill 0.813: 1 -2.413,0; 2 2.413,0
C0805' = smd 1.3 x 1.5: 1 -0.85,0; 2 0.85,0
C1210 = smd 1.6 x 2.7: 1 -1.4,0; 2 1.4,0
SSOP28DB = smd 0.348 x 1.397: 1 -4.225,-3.656; 2 -3.575,-3.656; 3 -2.925,-3.656; 4 -2.275,-3.656; 5 -1.625,-3.656; 6 -0.975,-3.656; 7 -0.325,-3.656; 8 0.325,-3.656; 9 0.975,-3.656; 10 1.625,-3.656; 11 2.275,-3.656; 12 2.925,-3.656; 13 3.575,-3.656; 14 4.225,-3.656; 15 4.225,3.656; 16 3.575,3.656; 17 2.925,3.656; 18 2.275,3.656; 19 1.625,3.656; 20 0.975,3.656; 21 0.325,3.656; 22 -0.325,3.656; 23 -0.975,3.656; 24 -1.625,3.656; 25 -2.275,3.656; 26 -2.925,3.656; 27 -3.575,3.656; 28 -4.225,3.656
DIL8 = drill 0.813 long: 1 -3.81,-3.81; 2 -1.27,-3.81; 3 1.27,-3.81; 4 3.81,-3.81; 5 3.81,3.81; 6 1.27,3.81; 7 -1.27,3.81; 8 -3.81,3.81
C025-024X044 = drill 0.813 octagon: 1 -1.27,0; 2 1.27,0
C025-025X050 = drill 0.813 octagon: 1 -1.27,0; 2 1.27,0
RCL_E3,5-8 = drill 0.813 pad 3: + -1.778,0 | drill 0.813 pad 3 octagon: - 1.778,0
0207/10 = drill 0.813 octagon: 1 -5.08,0; 2 5.08,0
SMARTPRJ_TQFP44-PAD = smd 1.4 x 0.45: 1 -5.8,4; 2 -5.8,3.2; 3 -5.8,2.4; 4 -5.8,1.6; 5 -5.8,0.8; 6 -5.8,0; 7 -5.8,-0.8; 8 -5.8,-1.6; 9 -5.8,-2.4; 10 -5.8,-3.2; 11 -5.8,-4; 23 5.8,-4; 24 5.8,-3.2; 25 5.8,-2.4; 26 5.8,-1.6; 27 5.8,-0.8; 28 5.8,0; 29 5.8,0.8; 30 5.8,1.6; 31 5.8,2.4; 32 5.8,3.2; 33 5.8,4 | smd 0.45 x 1.4: 12 -4,-5.8; 13 -3.2,-5.8; 14 -2.4,-5.8; 15 -1.6,-5.8; 16 -0.8,-5.8; 17 0,-5.8; 18 0.8,-5.8; 19 1.6,-5.8; 20 2.4,-5.8; 21 3.2,-5.8; 22 4,-5.8; 34 4,5.8; 35 3.2,5.8; 36 2.4,5.8; 37 1.6,5.8; 38 0.8,5.8; 39 0,5.8; 40 -0.8,5.8; 41 -1.6,5.8; 42 -2.4,5.8; 43 -3.2,5.8; 44 -4,5.8 | smd 1 x 1: P$1 0,0
SUPER-SOT3 = smd 1 x 1.4: 1 -0.95,-1.1; 2 0.95,-1.1; 3 0,1.1
TQFP44 = smd 1.5 x 0.5: 1 -5.8,4; 2 -5.8,3.2; 3 -5.8,2.4; 4 -5.8,1.6; 5 -5.8,0.8; 6 -5.8,0; 7 -5.8,-0.8; 8 -5.8,-1.6; 9 -5.8,-2.4; 10 -5.8,-3.2; 11 -5.8,-4; 23 5.8,-4; 24 5.8,-3.2; 25 5.8,-2.4; 26 5.8,-1.6; 27 5.8,-0.8; 28 5.8,0; 29 5.8,0.8; 30 5.8,1.6; 31 5.8,2.4; 32 5.8,3.2; 33 5.8,4 | smd 0.5 x 1.5: 12 -4,-5.8; 13 -3.2,-5.8; 14 -2.4,-5.8; 15 -1.6,-5.8; 16 -0.8,-5.8; 17 0,-5.8; 18 0.8,-5.8; 19 1.6,-5.8; 20 2.4,-5.8; 21 3.2,-5.8; 22 4,-5.8; 34 4,5.8; 35 3.2,5.8; 36 2.4,5.8; 37 1.6,5.8; 38 0.8,5.8; 39 0,5.8; 40 -0.8,5.8; 41 -1.6,5.8; 42 -2.4,5.8; 43 -3.2,5.8; 44 -4,5.8
SO16 = smd 0.66 x 2.032: 1 -4.445,-3.073; 2 -3.175,-3.073; 3 -1.905,-3.073; 4 -0.635,-3.073; 5 0.635,-3.073; 6 1.905,-3.073; 7 3.175,-3.073; 8 4.445,-3.073; 9 4.445,3.073; 10 3.175,3.073; 11 1.905,3.073; 12 0.635,3.073; 13 -0.635,3.073; 14 -1.905,3.073; 15 -3.175,3.073; 16 -4.445,3.073
SOIC8 = smd 0.6 x 2.2: 1 -1.905,-2.6; 2 -0.635,-2.6; 3 0.635,-2.6; 4 1.905,-2.6; 5 1.905,2.6; 6 0.635,2.6; 7 -0.635,2.6; 8 -1.905,2.6
SO20W = smd 0.66 x 2.032: 1 -5.715,-5.029; 2 -4.445,-5.029; 3 -3.175,-5.029; 4 -1.905,-5.029; 5 -0.635,-5.029; 6 0.635,-5.029; 7 1.905,-5.029; 8 3.175,-5.029; 9 4.445,-5.029; 10 5.715,-5.029; 11 5.715,5.029; 12 4.445,5.029; 13 3.175,5.029; 14 1.905,5.029; 15 0.635,5.029; 16 -0.635,5.029; 17 -1.905,5.029; 18 -3.175,5.029; 19 -4.445,5.029; 20 -5.715,5.029
SO14 = smd 0.66 x 2.032: 1 -3.81,-3.073; 2 -2.54,-3.073; 3 -1.27,-3.073; 4 0,-3.073; 5 1.27,-3.073; 6 2.54,-3.073; 7 3.81,-3.073; 8 3.81,3.073; 9 2.54,3.073; 10 1.27,3.073; 11 0,3.073; 12 -1.27,3.073; 13 -2.54,3.073; 14 -3.81,3.073
1X01 = drill 1.016 octagon: 1 0,0
C0603-ROUND = smd 0.898 x 1.1: 1 -0.889,0; 2 0.889,0
MINIMELF = smd 1.4 x 1.8: A 1.7,0; C -1.7,0
SOD80C = smd 1.4 x 1.8 bottom: A -1.7,0; C 1.7,0
L1812 = smd 1.9 x 3.4: 1 -1.95,0; 2 1.95,0
SML0603 = smd 0.8 x 0.8: A 0.75,0; C -0.75,0
PINHEAD_1X02 = drill 1.016 pad 2.3: 1 -1.27,0; 2 1.27,0
2X03 = drill 0.95 pad 1.55 octagon: 1 -2.54,-1.27; 2 -2.54,1.27; 3 0,-1.27; 4 0,1.27; 5 2.54,-1.27; 6 2.54,1.27
MA03-2 = drill 1.016: 1 -2.54,-1.27 | drill 1.016 octagon: 2 -2.54,1.27; 3 0,-1.27; 4 0,1.27; 5 2.54,-1.27; 6 2.54,1.27
SJ = smd 1.168 x 1.6: 1 -0.762,0; 2 0.762,0
R1206W' = smd 1.5 x 1.2 bottom: 1 1.499,0; 2 -1.499,0
JP2 = drill 0.914 long: 1 -2.54,0; 2 0,0; 3 2.54,0
JUMPER_JP2 = drill 0.914 pad 2.3 octagon: 1 -2.54,0; 2 0,0; 3 2.54,0
0805 = smd 1.2 x 1: 1 -1.1,0; 2 1.1,0
JP1 = drill 0.914 long: 1 0,-1.27; 2 0,1.27
A0R-JMP = smd 1.5 x 1.3: 1 0,1.7; 2 0,0; 3 0,-1.7
SML0805 = smd 1.2 x 1.2: A 1.05,0; C -1.05,0
TS42 = smd 1.6 x 1.4: 1 -4.2,2.25; 2 4.2,2.25; 3 -4.2,-2.25; 4 4.2,-2.25; 5 -4.2,0
CAY16 = smd 0.5 x 0.65: 1 -1.2,-0.675; 2 -0.4,-0.675; 3 0.4,-0.675; 4 1.2,-0.675; 5 1.2,0.675; 6 0.4,0.675; 7 -0.4,0.675; 8 -1.2,0.675
CT/CN0603 = smd 1 x 1: 1 -1,0; 2 1,0
1X03 = drill 1.016 long: 1 -2.54,0; 2 0,0; 3 2.54,0
FE12 = drill 0.813 pad 2.1 long: 1 -13.97,0; 2 -11.43,0; 3 -8.89,0; 4 -6.35,0; 5 -3.81,0; 6 -1.27,0; 7 1.27,0; 8 3.81,0 | drill 0.813 pad 2.1 square: 9 6.35,0; 10 8.89,0; 11 11.43,0
FE03-1 = drill 0.813 pad 2.1 long: 1 -2.54,0; 2 0,0; 3 2.54,0
FE08 = drill 0.813 pad 2.1 long: 1 -8.89,0; 2 -6.35,0; 3 -3.81,0; 4 -1.27,0; 5 1.27,0; 6 3.81,0; 7 6.35,0; 8 8.89,0
FE09 = drill 0.813 pad 2.1 long: 1 -10.16,0; 2 -7.62,0; 5 0,0; 6 2.54,0; 7 5.08,0; 8 7.62,0; 9 10.16,0 | drill 0.813 pad 2.1 square: 3 -5.08,0; 4 -2.54,0
CRYSTAL-3.2-2.5 = smd 1.3 x 1.05: 1 -1.15,-0.925; 2 1.15,-0.925; 3 1.15,0.925; 4 -1.15,0.925
HC49U-V = drill 0.813: 1 -2.413,0; 2 2.413,0

### Placement (x,y rotation side)
1C1  98.27,28.26 0 top
1C2  102.39,26.99 90 top
1C3  95.09,25.72 0 top
1C4  94.77,27.94 0 top
1C5  79.53,31.43 180 top
1C6  79.53,33.34 180 top
1C7  79.85,46.04 90 bottom
1C8  76.99,46.04 270 bottom
1C9  91.92,33.34 90 bottom
1C10  111.28,47.31 0 bottom
1C19  -15.72,-120.81 0 bottom  (outside the outline)
1C20  -30.16,-9.21 180 bottom  (outside the outline)
1C21  -26.04,-9.84 270 bottom  (outside the outline)
1C22  -34.77,-120.81 0 bottom  (outside the outline)
1C23  -41.12,-120.81 0 bottom  (outside the outline)
1C24  -47.47,-120.81 0 bottom  (outside the outline)
1D1  96.04,34.29 90 top
1R1  95.41,42.07 180 bottom
1R2  95.09,44.45 180 bottom
1R3  82.71,29.53 270 top
1R4  82.71,34.92 90 top
1R5  80.8,37.15 90 top
1R6  87.15,35.88 270 top
1R7  78.26,36.2 90 top
1R8  98.9,39.05 180 bottom
1R9  84.93,30.8 180 bottom
1R10  90.01,31.75 270 bottom
1R11  108.11,42.23 0 top
1R12  108.9,40.64 0 top
1R13  105.57,-35.08 180 top  (outside the outline)
1R14  70.64,-55.72 270 bottom  (outside the outline)
1R15  78.9,-54.77 180 bottom  (outside the outline)
1R16  78.9,-52.86 180 bottom  (outside the outline)
1R17  69.69,-52.86 0 bottom  (outside the outline)
1R28  -20.8,-114.46 0 bottom  (outside the outline)
1R29  -53.82,-120.81 0 bottom  (outside the outline)
1R30  -60.17,-120.81 0 bottom  (outside the outline)
1R31  -66.52,-120.81 0 bottom  (outside the outline)
1R32  -72.87,-120.81 0 bottom  (outside the outline)
1R33  -36.67,-32.86 0 bottom  (outside the outline)
1R34  -37.94,-36.04 0 bottom  (outside the outline)
1R35  -28.42,-127.16 0 bottom  (outside the outline)
1R36  -28.42,-114.46 0 bottom  (outside the outline)
1R37  -34.77,-127.16 0 bottom  (outside the outline)
1R38  -39.85,-101.76 0 bottom  (outside the outline)
1R39  -29.05,-34.13 180 bottom  (outside the outline)
1R40  -34.45,-49.05 90 bottom  (outside the outline)
1R41  -61.44,-125.89 0 bottom  (outside the outline)
1R42  -34.77,-114.46 0 bottom  (outside the outline)
1RJ  91.6,27.31 270 top
1VD3  -32.23,-97.95 0 bottom  (outside the outline)
1VT4  -15.72,-106.84 0 bottom  (outside the outline)
1VT5  -23.34,-106.84 0 bottom  (outside the outline)
1VT6  -30.96,-106.84 0 bottom  (outside the outline)
1X1  90.96,47.31 180 top
1X2  110.01,49.85 180 top
1Z1  100.81,27.94 135 bottom
2C1  20  [C0805']  116.36,26.99 270 bottom
2C2  20  [C0805']  120.97,27.15 270 bottom
2C3  100n  [C0805']  115.73,35.24 180 top
2C4  112.55,31.75 90 top
2C5  135.41,30.48 90 top
2D1  123.67,31.43 90 top
2D2  124.46,44.29 180 top
2R1  115.09,37.47 0 top
2R2  117,28.26 90 top
2R3  115.09,31.11 270 top
2R4  115.09,40.96 180 top
2R5  137.64,29.53 90 top
2R6  130.97,32.07 90 top
2R7  133.19,33.02 90 top
2R8  115.09,39.21 0 top
2R9  116.84,42.54 90 bottom
2R10  120.02,43.82 0 bottom
2Z1  118.9,23.5 180 top
3C6  3.33,-78.9 270 bottom  (outside the outline)
3C7  7.14,-82.71 0 bottom  (outside the outline)
3C8  -3.02,-81.44 270 bottom  (outside the outline)
3C9  -6.98,-6.98 270 bottom  (outside the outline)
3C10  -6.83,-73.82 180 bottom  (outside the outline)
3L2  22.38,-72.55 270 bottom  (outside the outline)
3R5  12.22,-66.2 0 bottom  (outside the outline)
3R6  7.14,-63.66 180 bottom  (outside the outline)
3R7  0.79,-64.93 0 bottom  (outside the outline)
3R8  2.06,-72.55 90 bottom  (outside the outline)
3VD2  14.76,-77.63 90 bottom  (outside the outline)
4C2  -15.72,-133.51 0 bottom  (outside the outline)
4D1  -83.98,23.97 270 top  (outside the outline)
4R6  -36.04,-133.51 0 bottom  (outside the outline)
4R7  -36.04,-104.3 0 bottom  (outside the outline)
4R8  -20.8,-133.51 0 bottom  (outside the outline)
4R9  -53.82,-130.97 0 bottom  (outside the outline)
4R10  -61.44,-108.11 0 bottom  (outside the outline)
4VT4  -38.58,-106.84 0 bottom  (outside the outline)
4VT5  -53.82,-97.95 0 bottom  (outside the outline)
4VT6  -63.98,-97.95 0 bottom  (outside the outline)
5D1  -29.21,-21.75 270 bottom  (outside the outline)
5D2  -26.19,-40.8 180 bottom  (outside the outline)
5D3  8.41,-72.55 0 bottom  (outside the outline)
5D4  -67.31,12.06 90 bottom  (outside the outline)
5D5  103.66,-26.19 270 top  (outside the outline)
5D6  117.16,-26.67 0 top  (outside the outline)
!OE  -93.66,14.45 90 top  (outside the outline)
!WR  -91.92,16.99 90 top  (outside the outline)
BS1  -86.52,14.29 90 top  (outside the outline)
BS2  -78.58,32.54 90 top  (outside the outline)
C1  -74.77,26.19 270 top  (outside the outline)
C2  -82.87,33.18 45 top  (outside the outline)
C17  -72.55,24.61 270 top  (outside the outline)
C18  -74.77,19.69 90 top  (outside the outline)
C19  -99.85,43.97 90 top  (outside the outline)
C20  -99.22,19.21 0 top  (outside the outline)
C24  -99.22,26.19 0 top  (outside the outline)
D1  -97.16,32.39 0 top  (outside the outline)
D2  78.9,-56.99 180 top  (outside the outline)
D3  78.9,-50.64 180 top  (outside the outline)
D6  72.23,-58.58 180 top  (outside the outline)
D7  66.2,-56.67 270 top  (outside the outline)
D8  66.2,-51.59 90 top  (outside the outline)
D9  70.01,-50.64 180 top  (outside the outline)
D10  63.66,-56.67 270 top  (outside the outline)
D11  63.66,-51.59 90 top  (outside the outline)
DATA0  -83.03,41.59 90 top  (outside the outline)
DATA1  -84.77,38.89 90 top  (outside the outline)
DATA2  -86.68,36.2 90 top  (outside the outline)
DATA3  -88.42,38.73 90 top  (outside the outline)
DATA4  -81.6,11.59 90 top  (outside the outline)
DATA5  -80.01,8.73 90 top  (outside the outline)
DATA6  -78.26,11.59 90 top  (outside the outline)
DATA7  -90.17,31.11 90 top  (outside the outline)
F1  84.61,42.54 180 bottom
F2  111.44,40.96 180 bottom
HL1  85.25,29.21 0 bottom
HL2  85.25,25.4 0 bottom
HL3  85.25,27.94 180 bottom
HL4  85.25,26.67 180 bottom
HW  -35.56,-53.97 270 bottom  (outside the outline)
HW1  -44.29,-97.31 270 bottom  (outside the outline)
ICSP1  -95.57,44.61 90 top  (outside the outline)
ISP1  -63.02,-46.51 0 bottom  (outside the outline)
J_U1  103.98,40.32 90 top
J_U2  J  [R1206W']  101.12,45.09 315 bottom
JD  118.27,43.66 180 top
JI  140.33,33.18 270 top
JO  128.27,20.8 180 top
JP  74.45,-53.82 90 top  (outside the outline)
JP1  -16.99,-97.95 0 bottom  (outside the outline)
JR  123.19,19.21 180 top
JRX  132.56,23.5 0 top
JS  133.03,12.54 180 top
JTX  129.38,16.19 180 top
JV1  -61.44,-136.05 0 bottom  (outside the outline)
JWP  129.7,44.93 270 bottom
JX1  -63.98,-85.25 0 bottom  (outside the outline)
L1  -97.79,35.88 180 top  (outside the outline)
L3  -76.83,29.53 270 top  (outside the outline)
LED  -33.81,-32.86 0 bottom  (outside the outline)
LEDS  -107.47,11.11 0 top  (outside the outline)
P_RESET  -106.2,25.56 180 top  (outside the outline)
PAG  -83.19,9.05 90 top  (outside the outline)
PINS  108.11,30.32 90 top
R1  -93.19,29.21 270 top  (outside the outline)
R2  -97.95,30.16 180 bottom  (outside the outline)
R4  -68.42,-7.46 270 top  (outside the outline)
R5  -77.63,17.78 50 top  (outside the outline)
R6  -79.69,-9.21 270 top  (outside the outline)
R7  -83.98,-7.78 270 top  (outside the outline)
R8  -86.2,-7.62 270 top  (outside the outline)
R9  -90.8,-6.67 270 top  (outside the outline)
R10  -88.9,-7.46 270 top  (outside the outline)
R11  -92.71,-6.83 270 top  (outside the outline)
R12  -94.77,-6.51 270 top  (outside the outline)
R13  -97.79,-6.51 270 top  (outside the outline)
R15  -99.22,14.45 180 top  (outside the outline)
R16  -64.45,20.32 0 top  (outside the outline)
R17  -61.44,21.91 0 top  (outside the outline)
R18  -62.23,24.45 0 top  (outside the outline)
R19  -62.86,26.83 0 top  (outside the outline)
R20  -62.39,30.32 0 top  (outside the outline)
R21  -61.75,32.23 0 top  (outside the outline)
R100  -94.77,23.97 270 top  (outside the outline)
R/!B  -95.41,16.99 90 top  (outside the outline)
READY  -33.97,-35.56 0 bottom  (outside the outline)
RES  -93.19,32.39 90 top  (outside the outline)
RES1  -15.72,-92.87 270 bottom  (outside the outline)
RESET  -94.3,30.16 0 bottom  (outside the outline)
RESET1  -84.3,-30.64 270 top  (outside the outline)
RN  101.12,41.59 0 top
RU1  99.54,46.35 90 bottom
RU2  95.41,40.64 0 bottom
RXTXLED  128.11,-31.59 90 top  (outside the outline)
SV1  73.66,41.91 270 top
SV2  63.5,27.94 90 top
SV3  50.8,16.51 90 top
SV5  85.88,18.1 0 top
SV6  88.74,11.75 0 top
T_RESET  -24.92,-31.75 0 top  (outside the outline)
U$3  [U235]  131.92,36.35 0 top
U_U1  96.04,32.39 0 bottom
U_U2  95.73,34.92 0 bottom
U_U3  109.38,37.78 0 bottom
U_U4  106.84,35.56 0 bottom
XA0  -90.01,14.61 90 top  (outside the outline)
XA1  -84.93,11.59 90 top  (outside the outline)
XTAL1  -99.22,16.99 90 top  (outside the outline)
Z1  -99.22,22.7 270 top  (outside the outline)
Z1A  -96.36,23.97 270 bottom  (outside the outline)
Z3  -26.99,-11.43 0 bottom  (outside the outline)

### Tracks (layer width: path | path; a pad name or v marks a point on that pad's centre or on a via)
3VUSB2  (2 unrouted)
  Top 0.305: 2C3.1 118.1,34.36 2D1.17 121.19,34.36 121.66,34.82
  Top 0.406: 121.66,34.82 121.66,35.98 120.65,36.99 120.33,37.15 116.52,40.96 2R4.1
  Bottom 0.61: 2D2.8 128.27,42.7 125.73,45.4 120.01,45.4 119.06,45.08 2R10.2 2R9.2
!HVPP_EN  (1 unrouted)
  Bottom 0.61: D9.A JP.3 D3.C 1R16.1
!ISP_EN  (1 unrouted)
  Bottom 0.61: 1R15.1 D2.C JP.1 D6.A
!OE741  (3 unrouted)
  Bottom 0.61: 1R17.2 D9.C
!OE!(UPD2)  (1 unrouted)
  Top 0.406: 4D1.20 -90.98,21.57 -93.66,18.89 !OE.1
+5V  (43 unrouted)
  Top 0.305: 118.62,29.81 2D1.24 121.76,29.81 121.76,31.75 | 2D1.19 118.59,33.06 118.59,32.41 2D1.20 121.76,32.41 121.76,31.75 | 2D1.8 127.32,31.75 121.76,31.75
  Top 0.406: -80.78,26.37 4D1.14 -91.3,26.37 R1.2 | -80.78,26.37 -80.78,27.78 | -80.78,27.78 4D1.2 | -80.78,26.37 -80.78,21.72 -79.03,19.97 4D1.34 R5.2 C18.1 | L3.1 -77.96,30.63 -78.9,29.21 -79.85,27.94 -80.78,27.78 | 2R3.1 115.54,33.06 118.59,33.06
  Top 0.61: 2C4.2 2R3.1
+12V  (5 unrouted)
AREF  (1 unrouted)
AVCC  (2 unrouted)
  Top 0.406: L3.2 -78.18,28.5 4D1.44 | 4D1.24 -87.18,16.96 -88.27,15.88 -88.27,12.22
CD2  (1 unrouted)
CR+  (1 unrouted)
CR-  (1 unrouted)
D+  (via drill 0.6 pad 2)  (1 unrouted)
  Top 0.406: RN.7 100.72,42.95 101.28,43.5 101.76,43.5 | 101.76,43.5 103.03,43.5 103.98,42.55 J_U1.2 | v97.95,44.45 99.22,45.72 100.49,45.72 101.76,44.45 101.76,43.5
  Bottom 0.61: 1R2.2 v97.95,44.45 RU1.1
D-  (via drill 0.6 pad 2)  (1 unrouted)
  Top 0.406: v98.27,42.23 RN.8 99.92,43.89 J_U2.1
  Bottom 0.406: RU2.1 96.26,40.79 1R1.2
  Bottom 0.61: 1R1.2 v98.27,42.23
DMI
  Top 0.305: 1D1.15 94.49,38.45 94.84,38.81
  Top 0.406: 94.84,38.81 96.36,40.32 98.9,40.32 RN.1
DPI
  Top 0.305: 1D1.16 95.12,37.81 95.64,38.34
  Top 0.406: 95.64,38.34 96.68,39.37 99.54,39.37 100.72,40.24 RN.2
GND  (via drill 0.6 pad 2)  (65 unrouted)
  Top 0.305: Z1.2 Z1.4 | 1D1.1 98.23,30.13 96.68,29.21 | 2D1.26 118.27,28.51 | 118.27,28.51 118.27,29.16 2D1.25 122.34,29.16 124.29,31.11 2D1.7 | 118.27,28.51 118.12,28.51 117.43,27.83 2R2.1 | 2D1.21 116.67,31.76 115.73,31.12 114.14,31.12 113.38,30.93 2C4.1 | 2D1.18 116.95,33.71 116.68,33.97 115.41,33.97 114.88,34.51
  Top 0.406: 4D1.23 -87.98,20.77 | -87.98,20.77 -87.98,25.57 4D1.15 -92.88,25.57 -96.68,29.69 -100.17,29.69 -101.76,27.46 -101.76,22.7 -100.61,21.55 Z1.2 | -87.98,20.77 -83.98,20.77 | -83.98,20.77 -81.26,20.77 -76.2,16.67 -75.09,16.67 -73.66,18.1 -73.66,19.74 -74.69,20.77 | 1C3.2 96.49,24.26 96.04,23.81 92.55,23.81 v91.28,24.45 | 4D1.P$1 -83.98,20.77 | 96.68,29.21 1C4.2 | C20.1 -100.81,19.21 -101.6,18.42 -101.6,15.88 R15.2 | 4D1.35 -74.69,20.77 | -74.69,20.77 C18.2 | 114.88,34.51 2C3.2
  Top 0.61: Z1.2 C20.1 | Z1.4 C24.2 | 1C6.2 1R7.1 | 1C1.1 1C4.2 1C3.2 98.08,24.13 100.17,24.13 1C2.1 | 2C3.2 111.28,35.24 110.01,33.97 110.01,31.12 110.78,30.35 2C4.1 112.55,28.58 v113.19,27.94 113.72,27.41 2R2.1
  Top 1.016: 1C6.2 1C5.2 78.58,27.3 84.3,23.5 90.33,23.5 v91.28,24.45 1RJ.2
  Bottom 0.406: 84.61,46.98 1X1.S2
  Bottom 0.61: 84.61,46.98 84.61,40.01 84.93,39.69 93.14,39.69 RU2.2 94.41,39.74 95.09,39.05 1R8.1 | 1X2.4 106.51,47.3 107.63,47.31 1C10.2 | 2C2.1 116.52,28 2C1.1 113.29,27.84 v113.19,27.94 | 1R17.1 70.64,-53.82 | 70.64,-53.82 1R14.1 | JP.2 70.64,-53.82
  Bottom 0.813: JWP.1 128.56,48.1 2D2.1
  Bottom 1.016: 89.55,47.31 1X1.S1 99.49,47.31 | 89.55,47.31 1X1.S2 1C7.- 1C8.1 | 1X1.4 89.55,47.31 | 1X2.4 106.22,47.31 | 106.22,47.31 99.49,47.31 | RU1.2 99.49,47.31 | 1C9.1 91.92,25.08 v91.28,24.45 | 2D2.1 2D2.2 2D2.3 2D2.4 120.17,48.1 118.9,49.53 106.54,49.53 106.22,47.31
HWB
  Top 0.406: 4D1.33 R5.1
ID+
  Bottom 0.406: 1R2.1 1X1.3
ID-
  Bottom 0.406: 1R1.1 94.19,42.12 1X1.2
LED/!STK500  (6 unrouted)
MISO8535  (4 unrouted)
MOSI8535  (4 unrouted)
N1  (2 unrouted)
N$1
  Top 0.406: -98.58,23.65 -98.27,23.65
N$2  (1 unrouted)
N$3
  Bottom 0.61: R2.2 RESET.A
N$4  (1 unrouted)
N$5
  Top 0.305: 1D1.9 103.67,35.25
  Top 0.406: 103.67,35.25 106.52,38.1 106.52,41.28 107.47,42.23 1R11.1
N$6
  Top 0.305: 1D1.8 104.62,34.61
  Top 0.406: 104.62,34.61 107.79,37.78 107.79,40.01 107.95,40.64 1R12.1
N$7
  Bottom 1.016: 1X1.1 F1.2
N$8
  Top 0.305: 1D1.2 99.88,30.77 100.49,30.16 100.49,28.89
  Top 0.61: 1Z1.1 1C1.2 99.85,28.26 100.49,28.89
N$9
  Top 0.305: 1D1.3 99.96,31.41 1Z1.2
  Top 0.61: 1C2.2 1Z1.2
N$10
  Top 0.305: 81.15,38.12 1R5.2
  Top 0.406: 1D1.17 90.62,37.17 88.42,38.74 88.11,39.05 86.2,39.05 84.93,38.1 80.81,38.1 1R5.2
N$11  (via drill 0.6 pad 2)
  Top 0.305: 1D1.22 90.66,33.99 v87.79,31.12
  Bottom 0.61: 1R9.2 v87.79,31.12 1R10.2
N$12
  Top 0.406: 1R11.2 108.96,43.15 1X2.3
N$13
  Top 0.406: 1X2.2 110.97,43.8 110.97,41.28 1R12.2
N$14  (via drill 0.6 pad 2)
  Top 0.305: 1D1.23 90.96,33.33 89.38,31.75 89.38,30.48 v87.79,28.89
  Bottom 0.61: HL3.A 86,28.89 | 86,28.89 HL1.C | v87.79,28.89 86,28.89
N$15
  Top 0.305: 1D1.19 89.71,35.89 88.42,35.88 82.39,35.88 1R4.2
N$16
  Top 0.305: 1D1.18 88.44,36.53 87.79,36.83 87.16,36.83 1R6.1
  Top 0.406: 1R7.2 79.85,37.15 86.2,37.15 1R6.1
N$17  (via drill 0.6 pad 2)
  Top 0.305: 1D1.24 91.27,32.69 90.01,31.43 90.01,30.16 89.38,29.53 89.38,28.26 v87.79,26.67
  Bottom 0.61: HL2.C HL4.A v87.79,26.67
N$18
  Bottom 0.61: HL2.A HL4.C 83.66,26.67 82.39,27.94 82.39,32.07 82.71,32.39 85.88,32.39 87.15,33.02 89.69,33.02 1R10.1
N$19
  Top 0.305: 1D1.26 91.26,31.41 90.65,30.8 90.65,29.85 90.01,29.21 90.01,26.35 88.42,24.77 85.57,24.77 82.71,26.67 1R3.2
N$20  (2 unrouted)
N$21  (via drill 0.6 pad 2)
  Top 0.305: 1D1.14 100.14,38.45 v101.76,39.05
  Bottom 0.61: 1R8.2 v101.76,39.05
N$22  (3 unrouted)
N$23
  Top 0.305: 1D1.27 91.89,30.77 91.6,30.48 1RJ.1
N$24  (1 unrouted)
N$25  (2 unrouted)
N$26  (1 unrouted)
N$27  (1 unrouted)
N$28  (1 unrouted)
N$29  (2 unrouted)
N$31
  Bottom 0.61: HL3.C HL1.A 1R9.1
N$32  (3 unrouted)
N$33  (2 unrouted)
N$34  (2 unrouted)
N$35  (1 unrouted)
N$36  (2 unrouted)
N$37
  Bottom 0.61: 2D2.7 125.73,38.1 126.52,37.31 129.7,37.31 130.33,37.94 130.33,43.02 JWP.2
N$39  (3 unrouted)
N$40  (1 unrouted)
N$43  (3 unrouted)
  Bottom 0.61: 1R14.2 D6.C
N$45  (1 unrouted)
N$46  (2 unrouted)
N$47  (1 unrouted)
N$48  (1 unrouted)
N$49  (3 unrouted)
N$50  (1 unrouted)
  Top 0.406: -90.17,32.7 -90.17,36.2 | -89.22,41.12 -89.22,44.61
N$52
  Top 0.305: 2D1.15 119.12,35.66 118.9,35.88
  Top 0.406: 118.9,35.88 118.9,36.99 116.68,39.21 2R8.2
N$53
  Top 0.305: 2D1.16 118.5,35.01 117.95,35.56
  Top 0.406: 117.95,35.56 117.95,36.51 117,37.47 2R1.2
N$54
  Top 0.305: 2D1.23 118.03,30.46 2R2.2
N$55
  Top 0.305: 2D1.22 117.64,31.11
  Top 0.406: 117.64,31.11 2R3.2
N$56
  Top 0.305: 2D1.28 118.93,27.21
  Top 0.406: 118.93,27.21 116.49,24.77 2Z1.2
  Bottom 0.61: 2C1.2 116.49,26.01 2Z1.2
N$57
  Top 0.305: 2D1.27 121.53,27.86 122.08,27.31 122.08,25.53
  Top 0.406: 122.08,25.53 122.08,23.62 2Z1.1
  Bottom 0.61: 2C2.2 121.32,25.95 2Z1.1
N$58  (1 unrouted)
N$59  (1 unrouted)
N$60  (1 unrouted)
N$61  (1 unrouted)
N$62  (1 unrouted)
N$63  (1 unrouted)
N$65  (4 unrouted)
N$66  (2 unrouted)
  Top 0.305: 2D1.14 123.89,35.66
  Top 0.406: 123.89,35.66 120.65,38.89
N$68
  Top 0.305: 2D1.13 128.51,35.01 129.06,35.56 129.06,36.2 128.43,36.83
  Top 0.406: 128.43,36.83 124.3,36.83 123.19,37.94 2D2.6
  Bottom 0.61: 2R10.1 123.19,43.81 2D2.6
N$69  (1 unrouted)
N$70  (1 unrouted)
N$75  (3 unrouted)
N$76  (2 unrouted)
N$79  (2 unrouted)
N$80  (2 unrouted)
N$81  (1 unrouted)
N$82  (2 unrouted)
N$83  (2 unrouted)
N$84  (2 unrouted)
N$85  (2 unrouted)
N$86  (2 unrouted)
N$95  (1 unrouted)
N$96  (1 unrouted)
N$111  (via drill 3 pad 5)
  other vias: 406.72,146.05
N$112  (via drill 3 pad 5)
  other vias: 422.59,146.05
N$113  (via drill 3 pad 5)
  other vias: 417.04,146.05
N$114  (via drill 3 pad 5)
  other vias: 244.63,146.05
N$115  (via drill 1 pad 2)
  other vias: 322.9,123.83
N$116  (via drill 1 pad 2)
  other vias: 341.95,123.83
N$117  (via drill 1 pad 2)
  other vias: 406.72,123.83
N$118  (via drill 1 pad 2)
  other vias: 361,123.83
N$119  (via drill 1 pad 2)
  other vias: 406.72,116.21
N$120  (via drill 1 pad 2)
  other vias: 406.72,97.16
N$121  (via drill 1 pad 2)
  other vias: 387.67,97.16
N$122  (via drill 1 pad 2)
  other vias: 368.62,97.16
N$123  (via drill 1 pad 2)
  other vias: 349.57,97.16
N$124  (via drill 1 pad 2)
  other vias: 306.7,97.16
N$125  (via drill 1 pad 2)
  other vias: 330.52,97.16
N$126  (via drill 1 pad 2)
  other vias: 267.02,85.72
N$127  (via drill 1 pad 2)
  other vias: 267.02,123.83
N$128  (via drill 1 pad 2)
  other vias: 268.6,104.78
N$129  (via drill 3 pad 5)
  other vias: 267.02,146.05
N$130  (via drill 3 pad 5)
  other vias: 322.9,146.05
N$131  (via drill 3 pad 5)
  other vias: 294.96,146.05
N$132  (via drill 3 pad 5)
  other vias: 383.86,146.05
N$133  (via drill 3 pad 5)
  other vias: 397.19,146.05
N$134  (via drill 3 pad 5)
  other vias: 341.95,146.05
N$135  (via drill 3 pad 5)
  other vias: 361,146.05
N$136  (via drill 3 pad 5)
  other vias: 244.63,123.83
N$137  (via drill 3 pad 5)
  other vias: 244.63,104.78
N$138  (via drill 3 pad 5)
  other vias: 244.63,85.72
N$250  (via drill 0.5 pad 0.61)
  other vias: 104.93,54.61
N$286  (via drill 3 pad 5)
  other vias: 165.26,54.45
N$287  (via drill 3 pad 5)
  other vias: 175.58,54.45
N$288  (via drill 3 pad 5)
  other vias: 3.17,54.45
N$291  (via drill 1 pad 2)
  other vias: 165.26,32.23
N$293  (via drill 1 pad 2)
  other vias: 165.26,24.61
N$294  (via drill 1 pad 2)
  other vias: 165.26,5.56
N$295  (via drill 1 pad 2)
  other vias: 146.21,5.56
N$296  (via drill 1 pad 2)
  other vias: 127.16,5.56
N$297  (via drill 1 pad 2)
  other vias: 108.11,5.56
N$305  (via drill 1 pad 2)
  other vias: 65.25,5.56
N$306  (via drill 1 pad 2)
  other vias: 89.06,5.56
N$330  (via drill 3 pad 5)
  other vias: 25.56,54.45
N$331  (via drill 3 pad 5)
  other vias: 81.44,54.45
N$332  (via drill 3 pad 5)
  other vias: 53.5,54.45
N$333  (via drill 3 pad 5)
  other vias: 142.4,54.45
N$334  (via drill 3 pad 5)
  other vias: 155.73,54.45
N$335  (via drill 3 pad 5)
  other vias: 100.49,54.45
N$336  (via drill 3 pad 5)
  other vias: 119.54,54.45
N$337  (via drill 3 pad 5)
  other vias: 3.17,32.23
N$338  (via drill 3 pad 5)
  other vias: 3.17,13.18
N$395  (via drill 3 pad 5)
  other vias: 181.13,54.45
PD2  (1 unrouted)
PD5  (1 unrouted)
PD7  (2 unrouted)
PPC2(!OE!)  (2 unrouted)
RD+  (1 unrouted)
  Top 0.305: 1D1.11 100.15,36.53
  Top 0.406: 100.15,36.53 100.19,36.53 100.49,36.83 102.08,36.83 103.98,38.74 J_U1.1
RD-  (1 unrouted)
  Top 0.305: 1D1.10 102.72,35.89
  Top 0.406: 102.72,35.89 105.57,38.74 105.57,42.76 J_U2.2
RESET8535  (6 unrouted)
RESET(P)  (2 unrouted)
RX_LED  (1 unrouted)
RX_STK500  (1 unrouted)
RX_USB  (2 unrouted)
SCK8535  (5 unrouted)
SWCLK(XTAL1)  (1 unrouted)
TRST(RESET)  (3 unrouted)
TX_LED  (1 unrouted)
TX_STK500  (1 unrouted)
TX_USB  (3 unrouted)
UCAP
  Top 0.406: 4D1.6 -83.98,31.91 C2.1
UGND  (1 unrouted)
  Top 0.406: 4D1.5 -83.18,31.44 -81.92,32.7 -81.92,33.43 C2.2
UMISO(D1)  (1 unrouted)
  Top 0.406: 4D1.11 -87.98,31.62 -88.42,32.07 DATA3.1
UMOSI(D2)  (1 unrouted)
  Top 0.406: 4D1.10 -87.18,34.42 -86.68,34.93 DATA2.1
UPB0
  Top 0.406: 4D1.8 -85.58,33.17 -83.82,34.93 -83.82,37.15 -83.03,37.94 DATA0.1
UPB4  (1 unrouted)
  Top 0.406: 4D1.28 -83.98,16.99 -81.6,13.81 DATA4.1
UPB5  (3 unrouted)
  Top 0.406: 4D1.29 -83.18,17.3 -80.8,14.13 -80.01,12.7 DATA5.1
UPB6  (3 unrouted)
  Top 0.406: 4D1.30 -82.38,17.45 -78.26,12.54 DATA6.1
UPB7  (3 unrouted)
  Top 0.406: -90.17,28.2 4D1.12
  Top 0.61: DATA7.1 -90.17,28.2 -90.17,28.1
UPC6  (1 unrouted)
UPC7  (2 unrouted)
UPD0
  Top 0.406: 4D1.18 -91.92,23.17 -97.31,18.1 -97.31,15.4 -97.32,15.4 R15.1
UPD1  (1 unrouted)
  Top 0.406: 4D1.19 -91.45,22.37 -95.41,18.42 R/!B.1
UPD3  (1 unrouted)
  Top 0.406: 4D1.21 -90.51,20.77 -91.92,19.37 !WR.1
UPD4  (1 unrouted)
  Top 0.406: 4D1.25 -86.38,14.75 BS1.1
UPD5  (1 unrouted)
  Top 0.406: XA0.1 -90.01,19.58 4D1.22
UPD6  (1 unrouted)
  Top 0.406: 4D1.26 -85.58,16.21 -84.93,15.24 XA1.1
UPD7  (1 unrouted)
  Top 0.406: 4D1.27 -84.78,16.52 -83.19,14.45 PAG.1
UPE6  (1 unrouted)
UPF0  (1 unrouted)
UPF1  (1 unrouted)
UPF4  (1 unrouted)
UPF5  (1 unrouted)
UPF6  (1 unrouted)
UPF7  (1 unrouted)
URESET  (5 unrouted)
  Top 0.406: 4D1.13 -90.67,27.17 -91.6,28.1 -91.6,29.37 -92.39,30.16 R1.1
  Top 0.61: RES.1 R1.1
  Bottom 0.61: RESET.C RES.1
USCK(D3)  (1 unrouted)
  Top 0.406: 4D1.9 -86.38,33.64 -86.36,33.81 -85.73,34.45 -84.77,35.24 DATA1.1
UU+
  Top 0.305: 1D1.7 106.52,33.97
  Top 0.406: 106.52,33.97 111.76,39.21 2R8.1 2R4.2
UU-
  Top 0.305: 1D1.6 107.47,33.33
  Top 0.406: 107.47,33.33 111.6,37.47 2R1.1
VD1V8
  Top 0.305: 1D1.12 97.65,37.17 | 94.42,30.13 1D1.28
  Top 0.406: 1C4.1 94.42,29.25 94.42,30.13 96.68,31.43 96.68,36.2 97.65,37.17
  Top 0.61: 1C3.1 1C4.1
VD3V3
  Top 0.305: 1R4.1 83.98,32.7 88.11,32.7 90.33,34.61 1D1.21 94.77,34.61 | 1D1.13 96.71,37.81
  Top 0.406: 94.77,34.61 95.73,35.56 95.73,36.83 96.71,37.81
  Top 0.61: 1R4.1 1R3.1 1C5.1 1C6.1 1R5.1
VTG  (3 unrouted)
VUSB  (via drill 0.6 pad 2)  (1 unrouted)
  Top 0.305: 1D1.20 90.02,35.25 88.74,34.93 87.16,34.93 1R6.2
  Top 0.406: 4D1.7 -84.78,32.7 -82.87,34.61 -82.87,36.83 -81.28,38.42 -81.28,41.59
  Top 0.61: 1R6.2 87.07,34.29 v85.25,34.29
  Bottom 0.61: v85.25,34.29 85.88,34.29 1C9.2 95.09,37.47 102.71,37.47 106.2,40.64
  Bottom 1.016: 1C8.2 1C7.+ F1.1 82.71,38.78 v85.25,34.29
VUSBH
  Bottom 0.305: F2.2 F2.1
  Bottom 0.61: 1C10.1 117,47.31 116.68,46.99 113.66,44.49 1X2.1
  Bottom 1.016: F2.2 113.51,41.08 1X2.1
XTAL1
  Top 0.406: 4D1.17 -92.36,23.97 R100.2
  Top 0.61: XTAL1.1 -98.37,17.84 C20.2 Z1.3 Z1A.2 R100.2
XTAL2
  Top 0.406: 4D1.16 -92.21,24.77 R100.1
  Top 0.61: Z1.1 C24.1 -100.11,27.21 -99.22,28.1 -97.44,28.1 Z1A.1 R100.1

### Text on the board
Bottom: 1179-16